# EAGLE design power electronicsV4.4 (EAGLE 9.6.2)

## Sheet 1 of 3
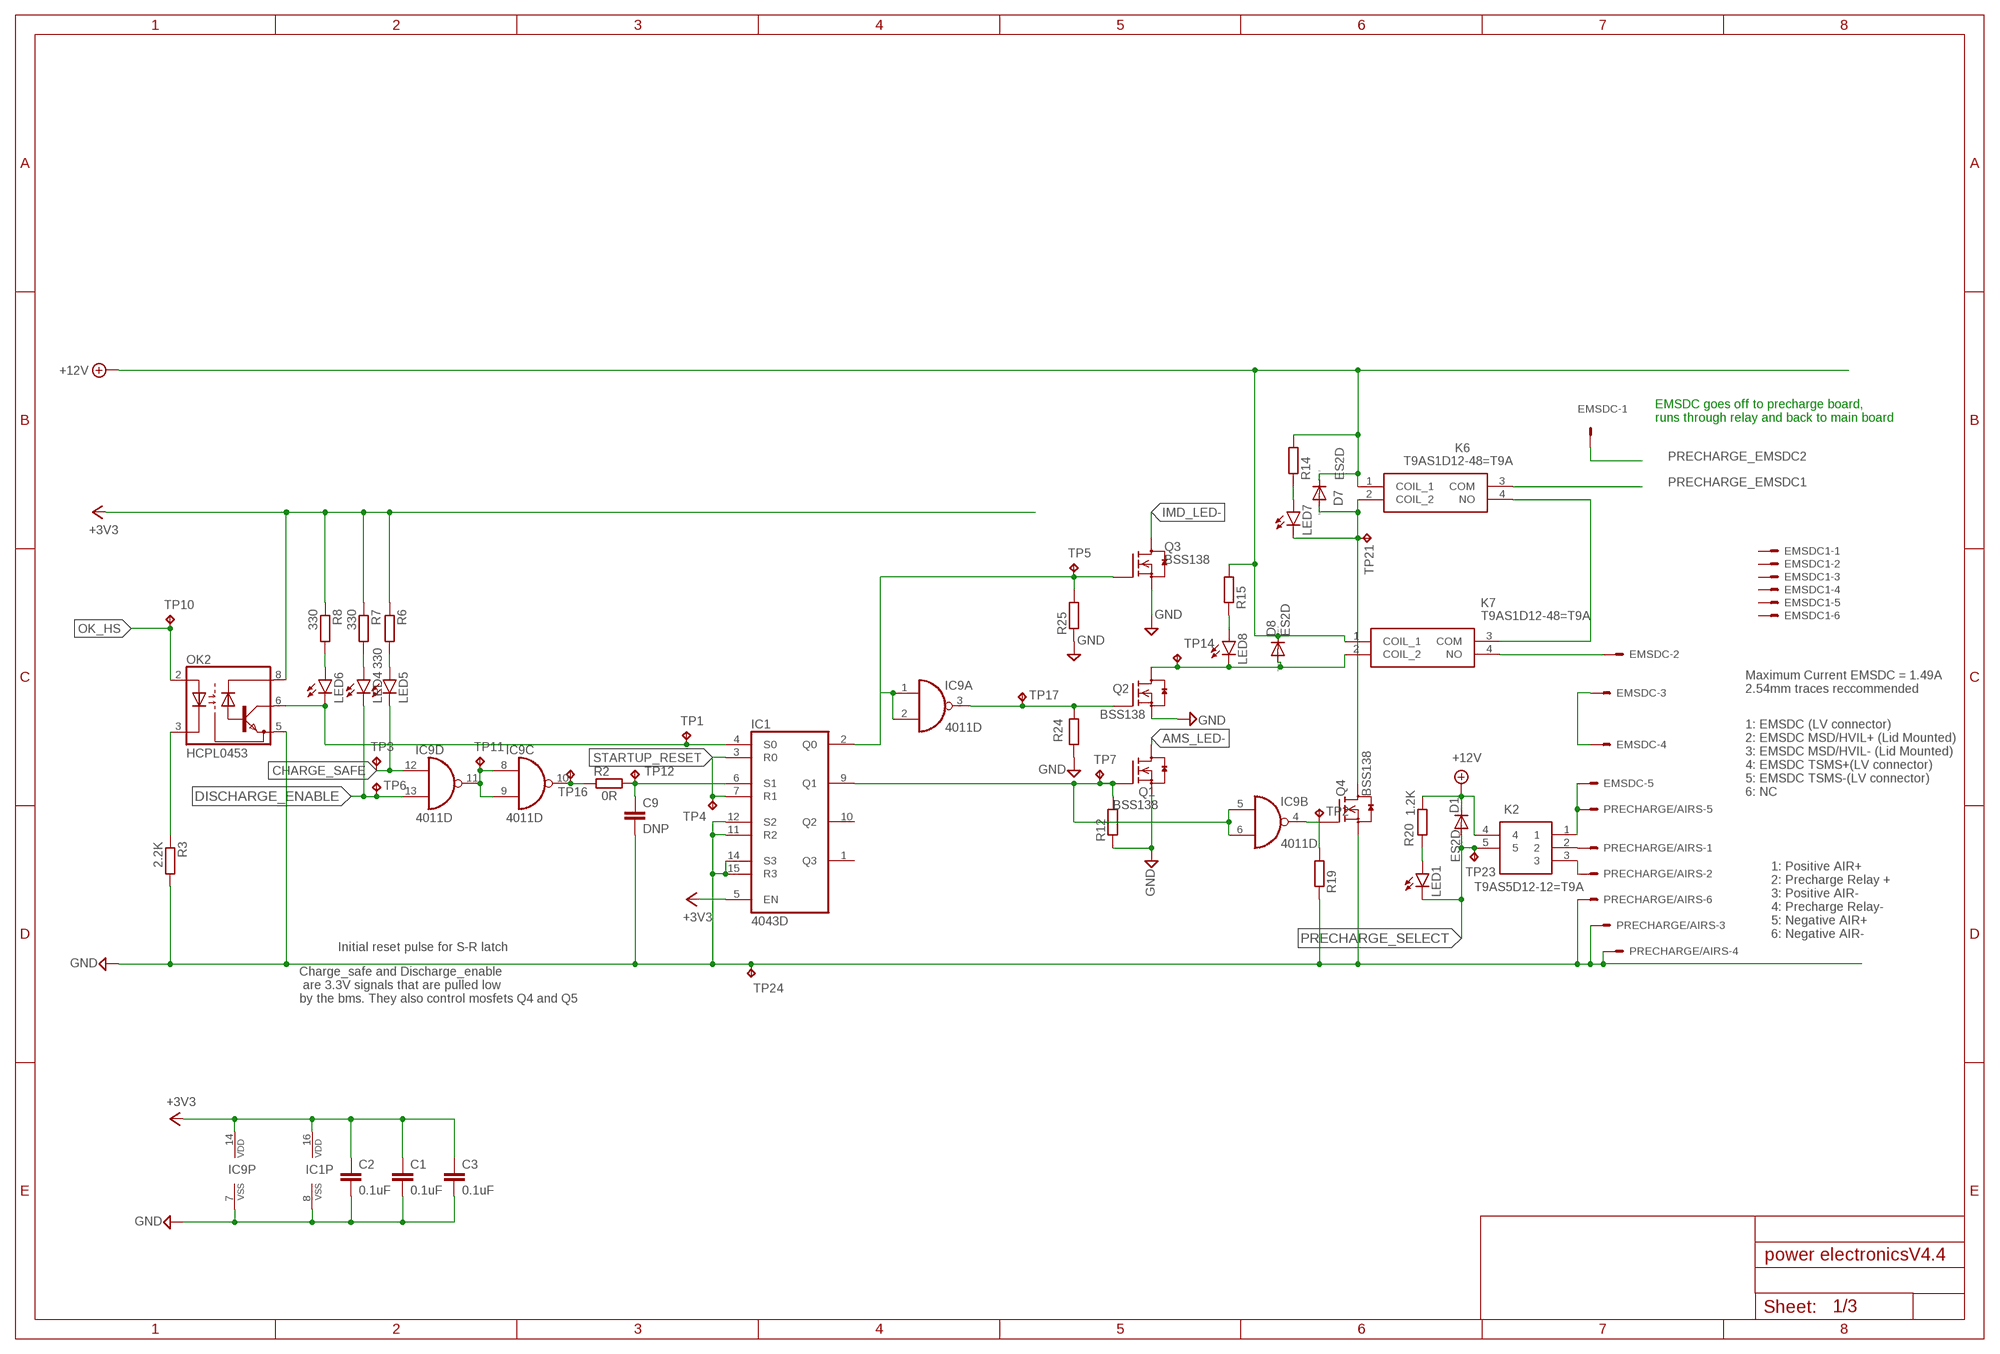
[diagram p0: schematic, sheet 1]

### Parts
C1  0.1uF  C-EUC0805  [C0805]
C2  0.1uF  C-EUC0805  [C0805]
C3  0.1uF  C-EUC0805  [C0805]
C9  DNP  C-EUC0805K  [C0805K]
D1  ES2D  [SMB]
D7  ES2D  [SMB]
D8  ES2D  [SMB]
EMSDC  KK-156-6  [KK-156-6]
EMSDC1  KK-156-6  [KK-156-6]
IC1  4043D  [SO16]
IC9  4011D  [SO14]
K2  T9AS5D12-12=T9A  [T9AS1D12]
K6  T9AS1D12-48=T9A  [T9AS1D1248T9A]
K7  T9AS1D12-48=T9A  [T9AS1D1248T9A]
LED1  LEDSML0805  [SML0805]
LED4  LEDSML0805  [SML0805]
LED5  LEDSML0805  [SML0805]
LED6  LEDSML0805  [SML0805]
LED7  LEDSML0805  [SML0805]
LED8  LEDSML0805  [SML0805]
OK2  HCPL0453  [SOIC08]
PRECHARGE/AIRS  KK-156-6  [KK-156-6]
Q1  BSS138  [SOT23]
Q2  BSS138  [SOT23]
Q3  BSS138  [SOT23]
Q4  BSS138  [SOT23]
R2  0R  R-EU_R0805  [R0805]
R3  2.2K  R-EU_R0805  [R0805]
R6  330  R-EU_R0805  [R0805]
R7  330  R-EU_R0805  [R0805]
R8  330  R-EU_R0805  [R0805]
R12  R-EU_R0805  [R0805]
R14  R-EU_R0805  [R0805]
R15  R-EU_R0805  [R0805]
R19  R-EU_R0805  [R0805]
R20  1.2K  R-EU_R0805  [R0805]
R24  R-EU_R0805  [R0805]
R25  R-EU_R0805  [R0805]
TP1  TPPAD1-17  [P1-17]
TP2  TPPAD1-17  [P1-17]
TP3  TPPAD1-17  [P1-17]
TP4  TPPAD1-17  [P1-17]
TP5  TPPAD1-17  [P1-17]
TP6  TPPAD1-17  [P1-17]
TP7  TPPAD1-17  [P1-17]
TP10  TPPAD1-17  [P1-17]
TP11  TPPAD1-17  [P1-17]
TP12  TPPAD1-17  [P1-17]
TP14  TPPAD1-17  [P1-17]
TP16  TPPAD1-17  [P1-17]
TP17  TPPAD1-17  [P1-17]
TP21  TPPAD1-17  [P1-17]
TP23  TPPAD1-17  [P1-17]
TP24  TPPAD1-17  [P1-17]

### Nets
+3V3: C1.1 C2.1 C3.1 IC1.5(EN) IC1.16(VDD) IC9.14(P:VDD) OK2.8(VCC) R6.1 R7.1 R8.1 ; also sheet 2,3
+12V [power]: D1.C D7.C D8.C K2.4 K6.1(COIL_1) K7.1(COIL_1) R14.2 R15.2 R20.1 ; also sheet 2,3
AMS_LED-: Q1.3(D) ; also sheet 3
CHARGE_SAFE: IC9.12(D:I0) LED5.C TP3.TP ; also sheet 3
DISCHARGE_ENABLE: IC1.9(Q1) IC9.5(B:I0) IC9.6(B:I1) IC9.13(D:I1) LED4.C Q1.1(G) R12.2 TP6.TP TP7.TP ; also sheet 3
GND [GND]: C1.2 C2.2 C3.2 C9.2 IC1.8(VSS) IC1.11(R2) IC1.12(S2) IC1.14(S3) IC1.15(R3) IC9.7(P:VSS) OK2.5(GND) PRECHARGE/AIRS.3 PRECHARGE/AIRS.4 PRECHARGE/AIRS.6 Q1.2(S) Q2.2(S) Q3.2(S) Q4.2(S) R3.2 R12.1 R19.1 R24.1 R25.1 TP24.TP ; also sheet 2,3
IMD_COIL_OUT: D8.A K7.2(COIL_2) LED8.C Q2.3(D) TP14.TP
IMD_LED-: Q3.3(D) ; also sheet 3
N$1: IC9.10(C:O) R2.1 TP16.TP
N$3 [EMSDC]: K2.2 PRECHARGE/AIRS.1
N$5: IC1.4(S0) LED6.C OK2.6(VO) TP1.TP
N$6: IC9.8(C:I0) IC9.9(C:I1) IC9.11(D:O) TP11.TP
N$7: OK2.3(C) R3.1
N$8: IC9.3(A:O) Q2.1(G) R24.2 TP17.TP
N$9: IC1.2(Q0) IC9.1(A:I0) IC9.2(A:I1) Q3.1(G) R25.2 TP5.TP
N$10: C9.1 IC1.6(S1) R2.2 TP12.TP
N$11 [EMSDC]: EMSDC.5 K2.1 PRECHARGE/AIRS.5
N$12 [EMSDC]: K2.3 PRECHARGE/AIRS.2
N$14: EMSDC.2 K7.4(NO)
N$15 [GND]: D7.A K6.2(COIL_2) LED7.C Q4.3(D) TP21.TP
N$16: IC9.4(B:O) Q4.1(G) R19.2 TP2.TP
N$18: LED7.A R14.1
N$19 [EMSDC]: EMSDC.3 EMSDC.4
N$20: LED8.A R15.1
N$21 [GND]: K6.4(NO) K7.3(COM)
N$22: LED1.A R20.2
N$25: LED4.A R7.2
N$26: LED5.A R6.2
N$27: LED6.A R8.2
OK_HS: OK2.2(A) TP10.TP ; also sheet 3
PRECHARGE_EMSDC1: K6.3(COM) ; also sheet 3
PRECHARGE_EMSDC2: EMSDC.1 ; also sheet 3
PRECHARGE_SELECT: D1.A K2.5 LED1.C TP23.TP ; also sheet 3
STARTUP_RESET: IC1.3(R0) IC1.7(R1) TP4.TP ; also sheet 2
Unconnected: EMSDC1.1 EMSDC1.2 EMSDC1.3 EMSDC1.4 EMSDC1.5 EMSDC1.6 EMSDC.6 IC1.1(Q3) IC1.10(Q2)

### Notes on the sheet
- EMSDC goes off to precharge board, 
  runs through relay and back to main board
- Maximum Current EMSDC = 1.49A
  2.54mm traces reccommended
- 1: EMSDC (LV connector)
  2: EMSDC MSD/HVIL+ (Lid Mounted)
  3: EMSDC MSD/HVIL- (Lid Mounted)
  4: EMSDC TSMS+(LV connector)
  5: EMSDC TSMS-(LV connector)
  6: NC
- 1: Positive AIR+
  2: Precharge Relay +
  3: Positive AIR-
  4: Precharge Relay-
  5: Negative AIR+
  6: Negative AIR-
- Initial reset pulse for S-R latch
- Charge_safe and Discharge_enable
   are 3.3V signals that are pulled low 
  by the bms. They also control mosfets Q4 and Q5

## Sheet 2 of 3
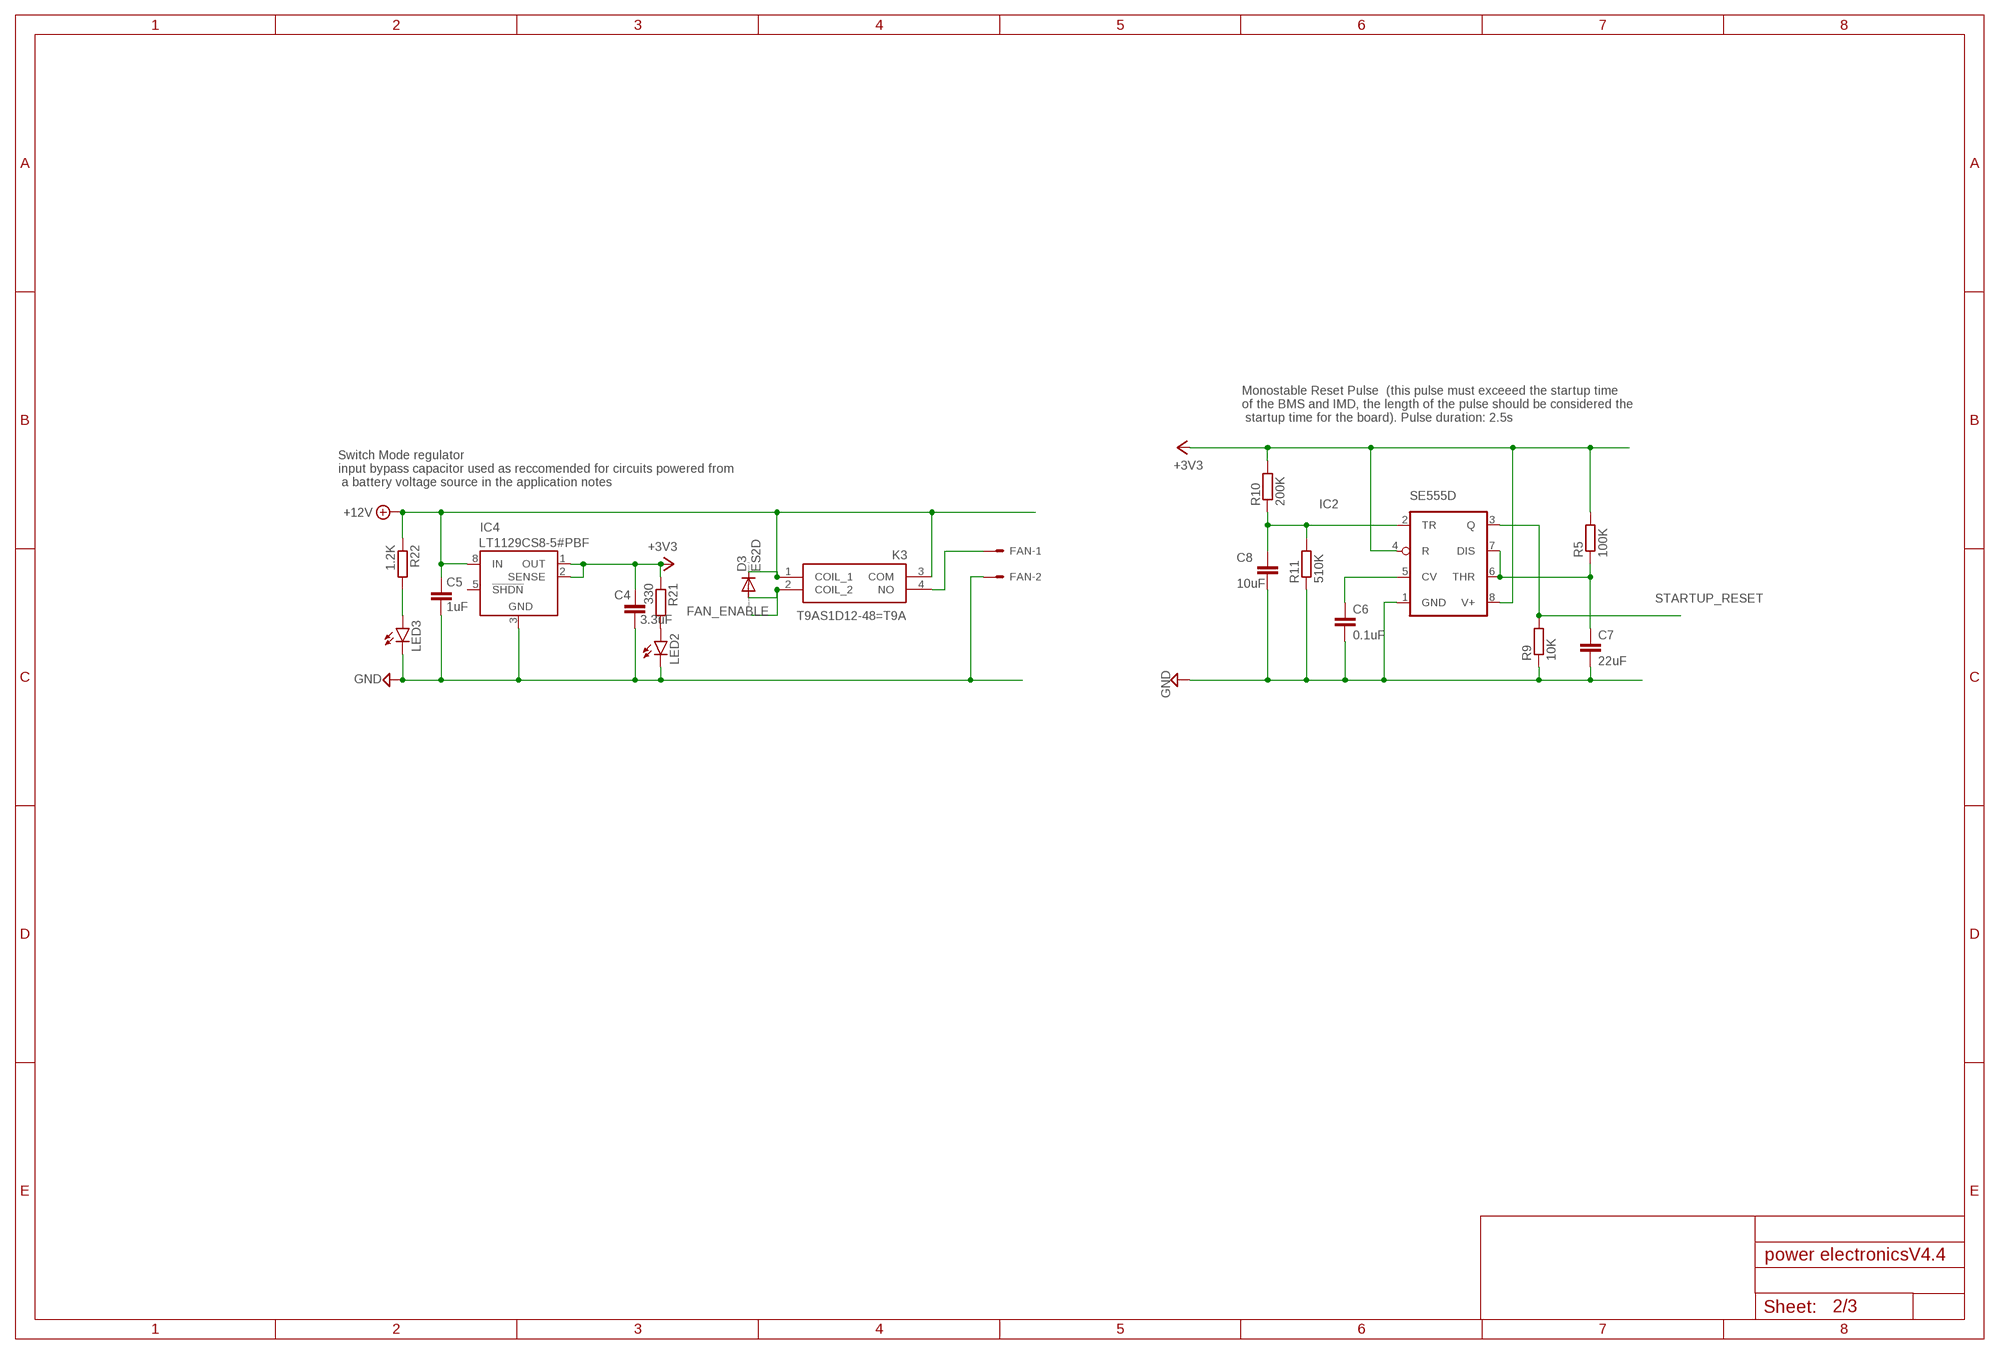
[diagram p1: schematic, sheet 2]

### Parts
C4  3.3uF  C-EUC0805  [C0805]
C5  1uF  C-EUC0805  [C0805]
C6  0.1uF  C-EUC0805  [C0805]
C7  22uF  C-EUC1206  [C1206]
C8  10uF  C-EUC0805  [C0805]
D3  ES2D  [SMB]
FAN  KK-156-2  [KK-156-2]
IC2  SE555D  [SO08]
IC4  LT1129CS8  [SOIC8]
K3  T9AS1D12-48=T9A  [T9AS1D1248T9A]
LED2  LEDSML0805  [SML0805]
LED3  LEDSML0805  [SML0805]
R5  100K  R-EU_R0805  [R0805]
R9  10K  R-EU_R0805  [R0805]
R10  200K  R-EU_R0805  [R0805]
R11  510K  R-EU_R0805  [R0805]
R21  330  R-EU_R0805  [R0805]
R22  1.2K  R-EU_R0805  [R0805]

### Nets
+3V3: C4.1 IC2.4(R) IC2.8(V+) IC4.1(OUT) IC4.2(SENSE) R5.2 R10.2 R21.1 ; also sheet 1,3
+12V [power]: C5.1 D3.C IC4.8(IN) K3.1(COIL_1) K3.3(COM) R22.1 ; also sheet 1,3
FAN+ [power]: FAN.1 K3.4(NO)
FAN_ENABLE: D3.A K3.2(COIL_2) ; also sheet 3
GND [GND]: C4.2 C5.2 C6.2 C7.2 C8.2 FAN.2 IC2.1(GND) IC4.3(GND) LED2.C LED3.C R9.1 R11.1 ; also sheet 1,3
N$17: C7.1 IC2.6(THR) IC2.7(DIS) R5.1
N$23: LED2.A R21.2
N$24: LED3.A R22.2
N$28: C8.1 IC2.2(TR) R10.1 R11.2
N$32: C6.1 IC2.5(CV)
STARTUP_RESET: IC2.3(Q) R9.2 ; also sheet 1
Unconnected: IC4.4(NC) IC4.5(!SHDN)

### Notes on the sheet
- Monostable Reset Pulse  (this pulse must exceeed the startup time 
  of the BMS and IMD, the length of the pulse should be considered the
   startup time for the board). Pulse duration: 2.5s
- Switch Mode regulator
  input bypass capacitor used as reccomended for circuits powered from
   a battery voltage source in the application notes

## Sheet 3 of 3
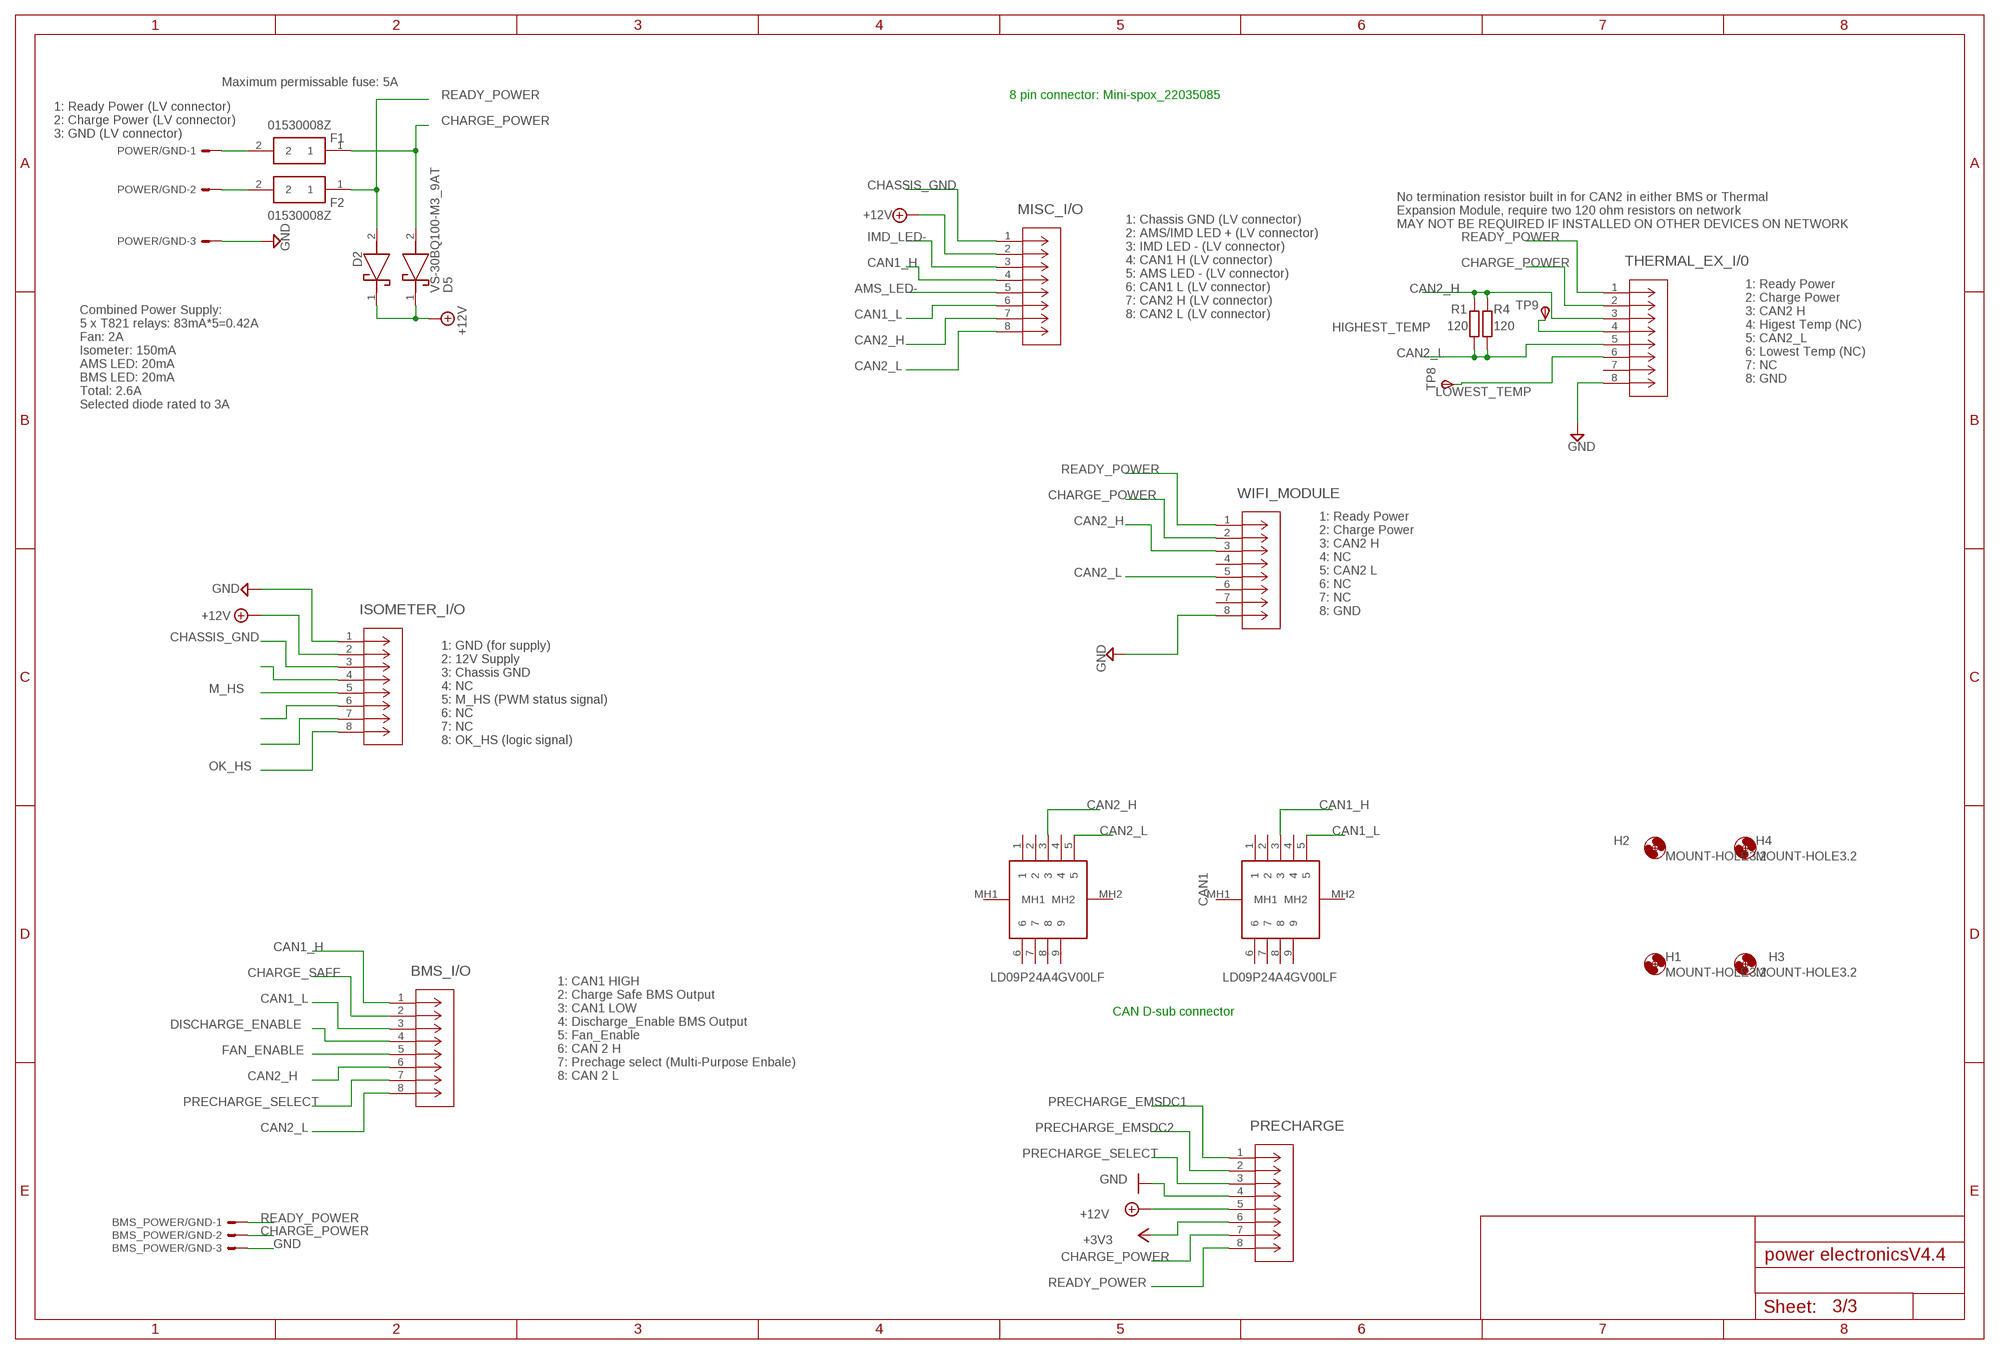
[diagram p2: schematic, sheet 3]

### Parts
BMS_I/O  MINI-SPOX_22035085  [CON_22035085_MOL]
BMS_POWER/GND  KK-156-3  [KK-156-3]
CAN1  LD09P24A4GV00LF  [LD09P24A4GV00LF]
CAN2  LD09P24A4GV00LF  [LD09P24A4GV00LF]
D2  VS-30BQ100-M3_9AT  [DIOM7959X262N]
D5  VS-30BQ100-M3_9AT  [DIOM7959X262N]
F1  01530008Z  [01530008]
F2  01530008Z  [01530008]
H1  MOUNT-HOLE3.2  [3,2]
H2  MOUNT-HOLE3.2  [3,2]
H3  MOUNT-HOLE3.2  [3,2]
H4  MOUNT-HOLE3.2  [3,2]
ISOMETER_I/O  MINI-SPOX_22035085  [CON_22035085_MOL]
MISC_I/O  MINI-SPOX_22035085  [CON_22035085_MOL]
POWER/GND  KK-156-3  [KK-156-3]
PRECHARGE  MINI-SPOX_22035085  [CON_22035085_MOL]
R1  120  R-EU_R1206  [R1206]
R4  120  R-EU_R1206  [R1206]
THERMAL_EX_I/0  MINI-SPOX_22035085  [CON_22035085_MOL]
TP8  TPSTP11R  [TP11R]
TP9  TPSTP11R  [TP11R]
WIFI_MODULE  MINI-SPOX_22035085  [CON_22035085_MOL]

### Nets
+3V3: PRECHARGE.6 ; also sheet 1,2
+12V [power]: D2.1(K) D5.1(K) ISOMETER_I/O.2 MISC_I/O.2 PRECHARGE.5 ; also sheet 1,2
AMS_LED-: MISC_I/O.5 ; also sheet 1
CAN1_H: BMS_I/O.1 CAN1.3 MISC_I/O.4
CAN1_L: BMS_I/O.3 CAN1.5 MISC_I/O.6
CAN2_H: BMS_I/O.6 CAN2.3 MISC_I/O.7 R1.1 R4.1 THERMAL_EX_I/0.3 WIFI_MODULE.3
CAN2_L: BMS_I/O.8 CAN2.5 MISC_I/O.8 R1.2 R4.2 THERMAL_EX_I/0.5 WIFI_MODULE.5
CHARGE_POWER [power]: BMS_POWER/GND.2 D5.2(A) F1.1 PRECHARGE.7 THERMAL_EX_I/0.2 WIFI_MODULE.2
CHARGE_SAFE: BMS_I/O.2 ; also sheet 1
CHASSIS_GND [GND]: ISOMETER_I/O.3 MISC_I/O.1
DISCHARGE_ENABLE: BMS_I/O.4 ; also sheet 1
FAN_ENABLE: BMS_I/O.5 ; also sheet 2
GND [GND]: BMS_POWER/GND.3 ISOMETER_I/O.1 POWER/GND.3 PRECHARGE.4 THERMAL_EX_I/0.8 WIFI_MODULE.8 ; also sheet 1,2
HIGHEST_TEMP: THERMAL_EX_I/0.4 TP9.TP(PP)
IMD_LED-: MISC_I/O.3 ; also sheet 1
LOWEST_TEMP: THERMAL_EX_I/0.6 TP8.TP(PP)
M_HS: ISOMETER_I/O.5
N$2 [power]: F2.2 POWER/GND.2
N$4 [power]: F1.2 POWER/GND.1
N$46: ISOMETER_I/O.4
N$51: ISOMETER_I/O.7
N$52: ISOMETER_I/O.6
OK_HS: ISOMETER_I/O.8 ; also sheet 1
PRECHARGE_EMSDC1: PRECHARGE.1 ; also sheet 1
PRECHARGE_EMSDC2: PRECHARGE.2 ; also sheet 1
PRECHARGE_SELECT: BMS_I/O.7 PRECHARGE.3 ; also sheet 1
READY_POWER [power]: BMS_POWER/GND.1 D2.2(A) F2.1 PRECHARGE.8 THERMAL_EX_I/0.1 WIFI_MODULE.1
Unconnected: CAN1.1 CAN1.2 CAN1.4 CAN1.6 CAN1.7 CAN1.8 CAN1.9 CAN1.MH1 CAN1.MH2 CAN2.1 CAN2.2 CAN2.4 CAN2.6 CAN2.7 CAN2.8 CAN2.9 CAN2.MH1 CAN2.MH2 THERMAL_EX_I/0.7 WIFI_MODULE.4 WIFI_MODULE.6 WIFI_MODULE.7

### Notes on the sheet
- Maximum permissable fuse: 5A
- 8 pin connector: Mini-spox_22035085
- 1: Ready Power (LV connector)
  2: Charge Power (LV connector)
  3: GND (LV connector)
- No termination resistor built in for CAN2 in either BMS or Thermal
  Expansion Module, require two 120 ohm resistors on network
  MAY NOT BE REQUIRED IF INSTALLED ON OTHER DEVICES ON NETWORK
- 1: Chassis GND (LV connector)
  2: AMS/IMD LED + (LV connector)
  3: IMD LED - (LV connector)
  4: CAN1 H (LV connector)
  5: AMS LED - (LV connector)
  6: CAN1 L (LV connector)
  7: CAN2 H (LV connector)
  8: CAN2 L (LV connector)
- 1: Ready Power
  2: Charge Power
  3: CAN2 H
  4: Higest Temp (NC)
  5: CAN2_L
  6: Lowest Temp (NC)
  7: NC
  8: GND
- Combined Power Supply:
  5 x T821 relays: 83mA*5=0.42A
  Fan: 2A
  Isometer: 150mA
  AMS LED: 20mA
  BMS LED: 20mA
  Total: 2.6A
  Selected diode rated to 3A
- 1: Ready Power
  2: Charge Power
  3: CAN2 H
  4: NC
  5: CAN2 L
  6: NC
  7: NC
  8: GND
- 1: GND (for supply) 
  2: 12V Supply
  3: Chassis GND 
  4: NC 
  5: M_HS (PWM status signal)
  6: NC
  7: NC
  8: OK_HS (logic signal)
- CAN D-sub connector
- 1: CAN1 HIGH
  2: Charge Safe BMS Output 
  3: CAN1 LOW
  4: Discharge_Enable BMS Output
  5: Fan_Enable
  6: CAN 2 H
  7: Prechage select (Multi-Purpose Enbale)
  8: CAN 2 L

## Power pins joined to a net without a drawn wire
GND: IC4.6(GND) IC4.7(GND)

## Library data of the parts
BMS_I/O ISOMETER_I/O MISC_I/O PRECHARGE THERMAL_EX_I/0 WIFI_MODULE = Mini-spox_22035085:MINI-SPOX_22035085; COPYRIGHT: Copyright (C) 2023 Ultra Librarian. All rights reserved.; MANUFACTURER_PART_NUMBER: 22035085; MFR_NAME: Molex Connector Corporation
BMS_POWER/GND POWER/GND = con-molex:KK-156-3: KK 156 HEADER Source: http://www.molex.com/pdm_docs/sd/026604100_sd.pdf; MF: MOLEX; OC_FARNELL: unknown; OC_NEWARK: unknown
C1-C9 = rcl:C-EU: CAPACITOR, European symbol; SPICEPREFIX: C
CAN1 CAN2 = LD09P24A4GV00LF:LD09P24A4GV00LF: Amphenol FCI LD Series, 9 Way Plug-In Mount D-sub Connector Plug, 2.74mm Pitch, with Screw Source: Datasheet <https://www.mouser.com/datasheet/2/18/10130912-1362365.pdf>; ARROW_PART_NUMBER: LD09P24A4GV00LF; ARROW_PRICE-STOCK: https://www.arrow.com/en/products/ld09p24a4gv00lf/amphenol-fci?region=nac; DESCRIPTION: Amphenol FCI LD Series, 9 Way Plug-In Mount D-sub Connector Plug, 2.74mm Pitch, with Screw; HEIGHT: 12.15mm; MANUFACTURER_NAME: Amphenol Communication Solutions; MANUFACTURER_PART_NUMBER: LD09P24A4GV00LF; MOUSER_PART_NUMBER: 649-LD09P24A4GV00LF; MOUSER_PRICE-STOCK: https://www.mouser.co.uk/ProductDetail/Amphenol-FCI/LD09P24A4GV00LF?qs=tZOhSuJQg1nfkziarphghA%3D%3D
D1 D3 D7 D8 = diode:ES2D: DIODE super fast rectifier, 2 A
D2 D5 = SamacSys_Parts:VS-30BQ100-M3_9AT: Vishay VS-30BQ100-M3/9AT SMT Schottky Diode, 100V 3A, 2-Pin DO-214AB Source: Datasheet <https://componentsearchengine.com/Datasheets/1/VS-30BQ100-M3_9AT.pdf>; DESCRIPTION: Vishay VS-30BQ100-M3/9AT SMT Schottky Diode, 100V 3A, 2-Pin DO-214AB; HEIGHT: 2.62mm; MANUFACTURER_NAME: Vishay; MANUFACTURER_PART_NUMBER: VS-30BQ100-M3/9AT; MOUSER_PART_NUMBER: 78-VS-30BQ100-M39AT; MOUSER_PRICE-STOCK: https://www.mouser.com/Search/Refine.aspx?Keyword=78-VS-30BQ100-M39AT
EMSDC EMSDC1 PRECHARGE/AIRS = con-molex:KK-156-6: KK 156 HEADER Source: http://www.molex.com/pdm_docs/sd/026604100_sd.pdf; MF: MOLEX; OC_FARNELL: unknown; OC_NEWARK: unknown
F1 F2 = SamacSys_Parts:01530008Z: Mini fuseholder,15A 32V Littelfuse 15A PCB Mount Fuse Holder Automotive Fuse, 32 V Source: Datasheet <http://www.littelfuse.com/data/en/data_sheets/153_pcmount.pdf>; ALLIED_NUMBER: 70184304; DESCRIPTION: Mini fuseholder,15A 32V Littelfuse 15A PCB Mount Fuse Holder Automotive Fuse, 32 V; HEIGHT: mm; MANUFACTURER_NAME: LITTELFUSE; MANUFACTURER_PART_NUMBER: 01530008Z; RS_PART_NUMBER: 3607317; RS_PRICE-STOCK: https://uk.rs-online.com/web/p/products/3607317
FAN = con-molex:KK-156-2: KK 156 HEADER Source: http://www.molex.com/pdm_docs/sd/026604100_sd.pdf; MF: MOLEX; OC_FARNELL: unknown; OC_NEWARK: unknown
H1-H4 = holes:MOUNT-HOLE: MOUNTING HOLE with drill center marker
IC1 = 40xx:4043: Quad 3-state NOR R/S LATCH
IC2 = linear:*555: TIMER
IC4 = linear-technology:LT1129CS8: VOLTAGE REGULATOR with shutdown; MPN: LT1129CS8-5#PBF; OC_FARNELL: 1273576; OC_NEWARK: 57M2078
IC9 = 40xx:4011: Quad 2-input NAND
K2 = SamacSys_Parts:T9AS5D12-12=T9A: PCB Relay SPDT 30A 12Vdc,thru hole SPDT PCB Mount Non-Latching Relay Through Hole, 12V dc Source: Datasheet; ALLIED_NUMBER: R1111589; DESCRIPTION: PCB Relay SPDT 30A 12Vdc,thru hole SPDT PCB Mount Non-Latching Relay Through Hole, 12V dc; HEIGHT: mm; MANUFACTURER_NAME: TE Connectivity; MANUFACTURER_PART_NUMBER: T9AS5D12-12=T9A; RS_PART_NUMBER: 6802528; RS_PRICE-STOCK: https://uk.rs-online.com/web/p/products/6802528
K3 = SamacSys_Parts:T9AS1D12-48=T9A: SPST-NO PCB Mount Non-Latching Relay Through Hole, 48V dc Source: Datasheet; DESCRIPTION: SPST-NO PCB Mount Non-Latching Relay Through Hole, 48V dc; HEIGHT: 20.4mm; MANUFACTURER_NAME: TE Connectivity; MANUFACTURER_PART_NUMBER: T9AS1D12-48=T9A; RS_PART_NUMBER: 6802534P; RS_PRICE-STOCK: http://uk.rs-online.com/web/p/products/6802534P
K6 K7 = T9AS1D12-12=T9A:T9AS1D12-48=T9A: SPST-NO PCB Mount Non-Latching Relay Through Hole, 48V dc Source: Datasheet; DESCRIPTION: SPST-NO PCB Mount Non-Latching Relay Through Hole, 48V dc; HEIGHT: 20.4mm; MANUFACTURER_NAME: TE Connectivity; MANUFACTURER_PART_NUMBER: T9AS1D12-48=T9A
LED1-LED8 = led:LED: LED OSRAM: - CHIPLED LG R971, LG N971, LY N971, LG Q971, LY Q971, LO R971, LY R971 LH N974, LH R974 LS Q976, LO Q976, LY Q976 LO Q996 - Hyper CHIPLED LW Q18S LB Q993, LB Q99A, LB R99A - SideLED LS A670, LO A670, LY A670, LG A670, LP A670 LB A673, LV A673, LT A673, LW A673 LH A674 LY A675 LS A676, LA A676, LO A676, LY A676, LW A676 LS A679, LY A679, LG A679 - Hyper Micro SIDELED® LS Y876, LA Y876, LO Y876, LY Y876 LT Y87S - SmartLED LW L88C, LW L88S LB L89C, LB L89S, LG L890 LS L89K, LO L89K, LY L89K LS L896, LA L896, LO L896, LY L896 - TOPLED LS T670, LO T670, LY T670, LG T670, LP T670 LSG T670, LSP T670, LSY T670, LOP T670, LYG T670 LG T671, LOG T671, LSG T671 LB T673, LV T673, LT T673, LW T673 LH T674 LS T676, LA T676, LO T676, LY T676, LB T676, LH T676, LSB T676, LW T676 LB T67C, LV T67C, LT T67C, LS T67K, LO T67K, LY T67K, LW E67C LS E67B, LA E67B, LO E67B, LY E67B, LB E67C, LV E67C, LT E67C LW T67C LS T679, LY T679, LG T679 LS T770, LO T770, LY T770, LG T770, LP T770 LB T773, LV T773, LT T773, LW T773 LH T774 LS E675, LA E675, LY E675, LS T675 LS T776, LA T776, LO T776, LY T776, LB T776 LHGB T686 LT T68C, LB T68C - Hyper Mini TOPLED® LB M676 - Mini TOPLED Santana® LG M470 LS M47K, LO M47K, LY M47K Source: http://www.osram.convergy.de LUXEON: - LUMILED® LXK2-PW12-R00, LXK2-PW12-S00, LXK2-PW14-U00, LXK2-PW14-V00 LXK2-PM12-R00, LXK2-PM12-S00, LXK2-PM14-U00 LXK2-PE12-Q00, LXK2-PE12-R00, LXK2-PE12-S00, LXK2-PE14-T00, LXK2-PE14-U00 LXK2-PB12-K00, LXK2-PB12-L00, LXK2-PB12-M00, LXK2-PB14-N00, LXK2-PB14-P00, LXK2-PB14-Q00 LXK2-PR12-L00, LXK2-PR12-M00, LXK2-PR14-Q00, LXK2-PR14-R00 LXK2-PD12-Q00, LXK2-PD12-R00, LXK2-PD12-S00 LXK2-PH12-R00, LXK2-PH12-S00 LXK2-PL12-P00, LXK2-PL12-Q00, LXK2-PL12-R00 Source: www.luxeon.com KINGBRIGHT: KA-3528ASYC Source: www.kingbright.com
OK2 = optocoupler:HCPL0453: HEWLETT PACKARD OPTO COUPLER; MF: AGILENT TECHNOLOGIES; MPN: HCPL-0453-000E; OC_FARNELL: 1505123; OC_NEWARK: 88H7766
Q1-Q4 = m-pad-2.1:BSS138: Fairchild Semiconductors BSS138 N-Channel Logic Level Enhancement Mode Field Effect Transistor General Description: These N-Channel enhancement mode field effect transistors are produced using Fairchild's proprietary, high cell density, DMOS technology. These products have been designed to minimize on-state resistance while provide rugged, reliable, and fast switching performance.These products are particularly suited for low voltage, low current applications such as small servo motor control, power MOSFET gate drivers, and other switching applications. Features: 0.22 A, 50 V. RDS(ON) = 3.5Ohm @ VGS = 10 V RDS(ON) = 6.0Ohm @ VGS = 4.5 V High density cell design for extremely low RDS(ON) Rugged and Reliable Compact industry standard SOT-23 surface mount package Please send any comments to: messi@users.sourceforge.net
R1-R12 R14 R15 R19-R22 R24 R25 = rcl:R-EU_: RESISTOR, European symbol; SPICEPREFIX: R
TP1-TP7 TP10-TP12 TP14 TP16 TP17 TP21 TP23 TP24 = testpad:TP: Test pad
TP8 TP9 = testpad:TPS: TEST PIN

## Net classes
0 default: width 0.508 mm
1 GND: width 0.889 mm
2 EMSDC: width 2.54 mm
3 power: width 0.889 mm

## Board
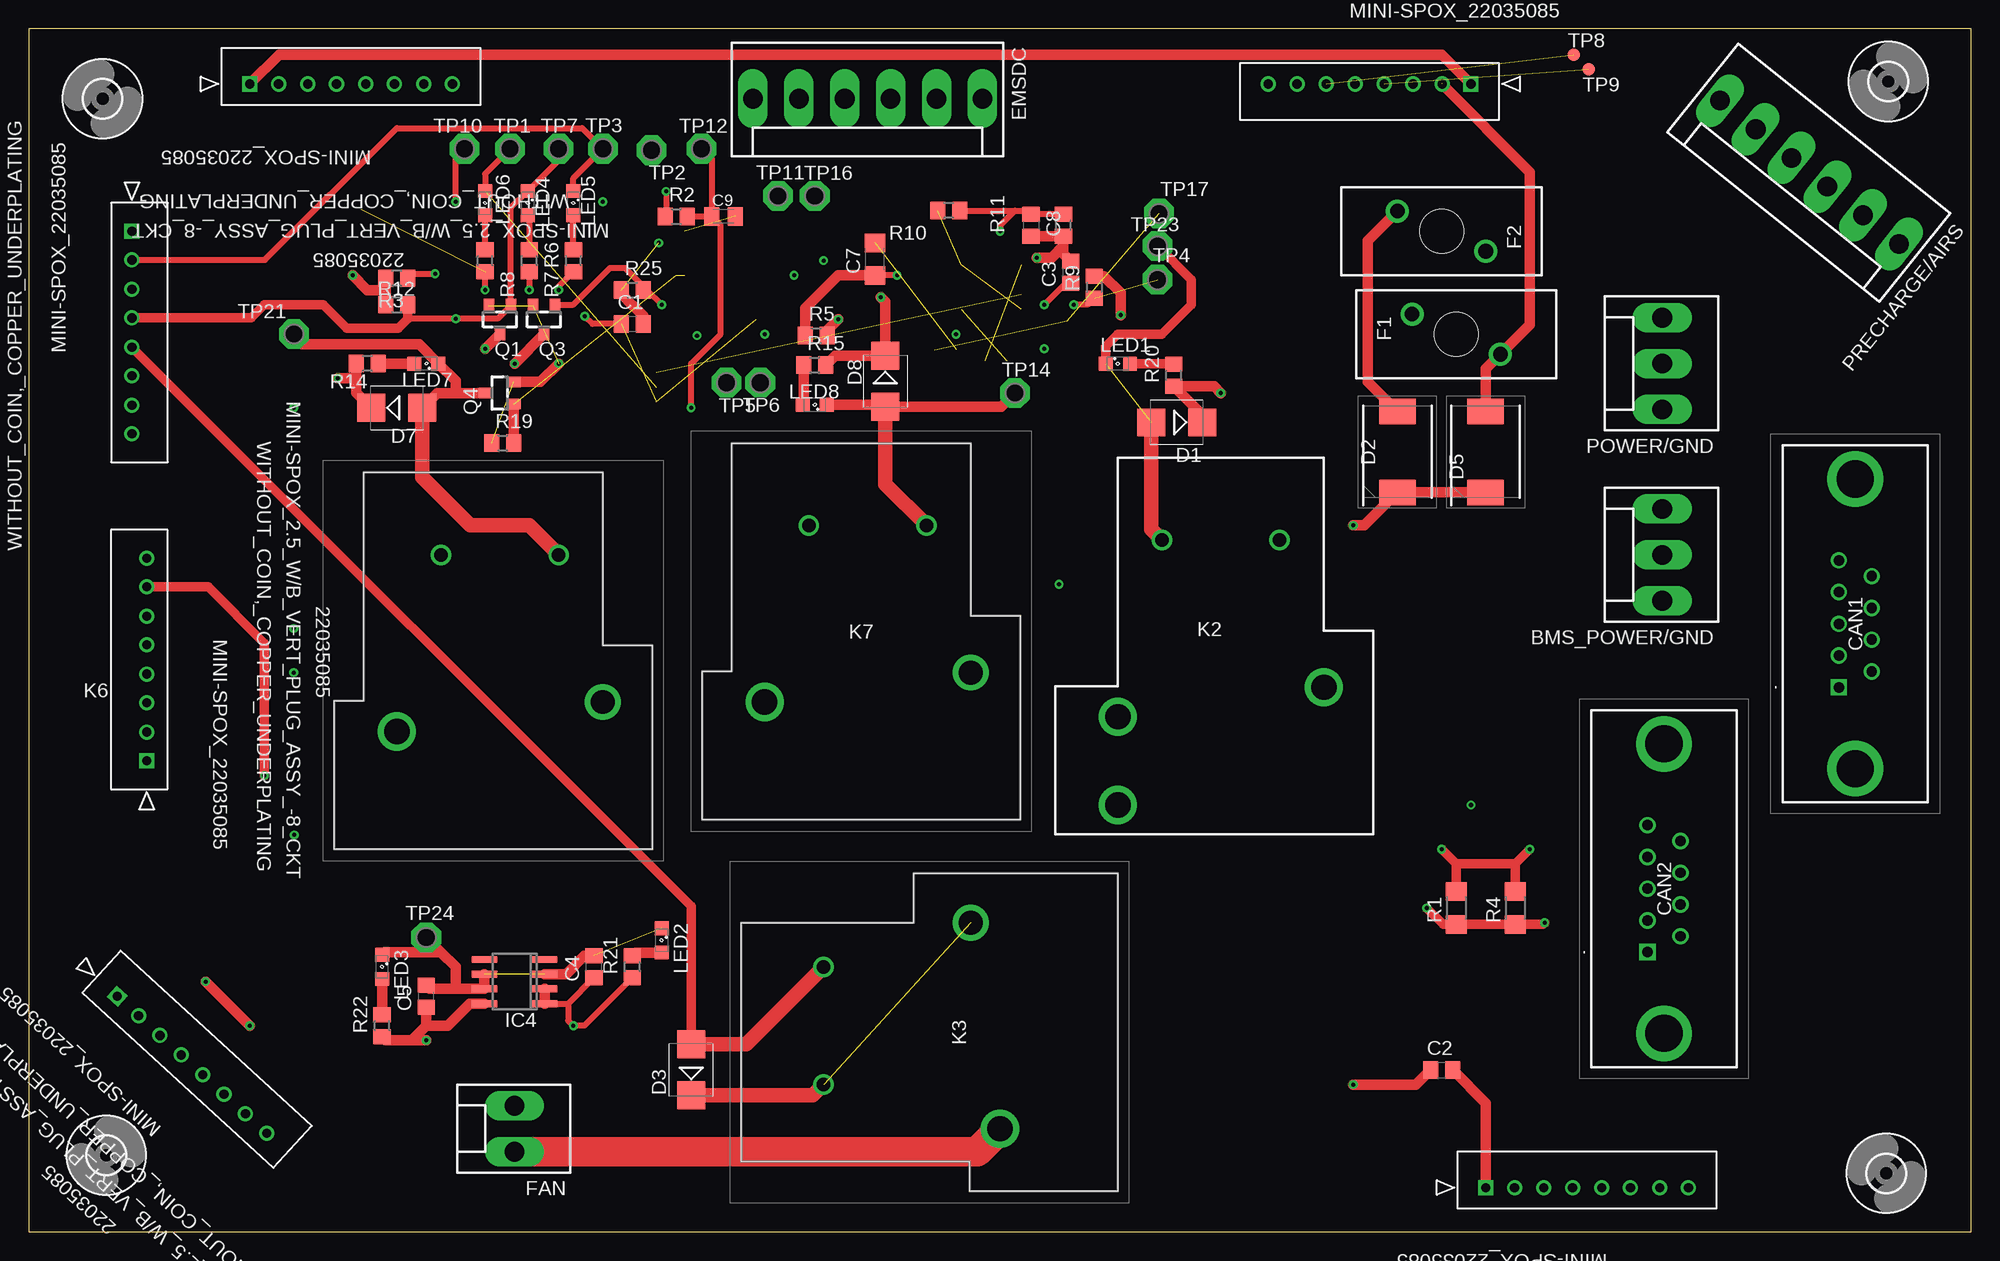
[diagram p3: board, top side]
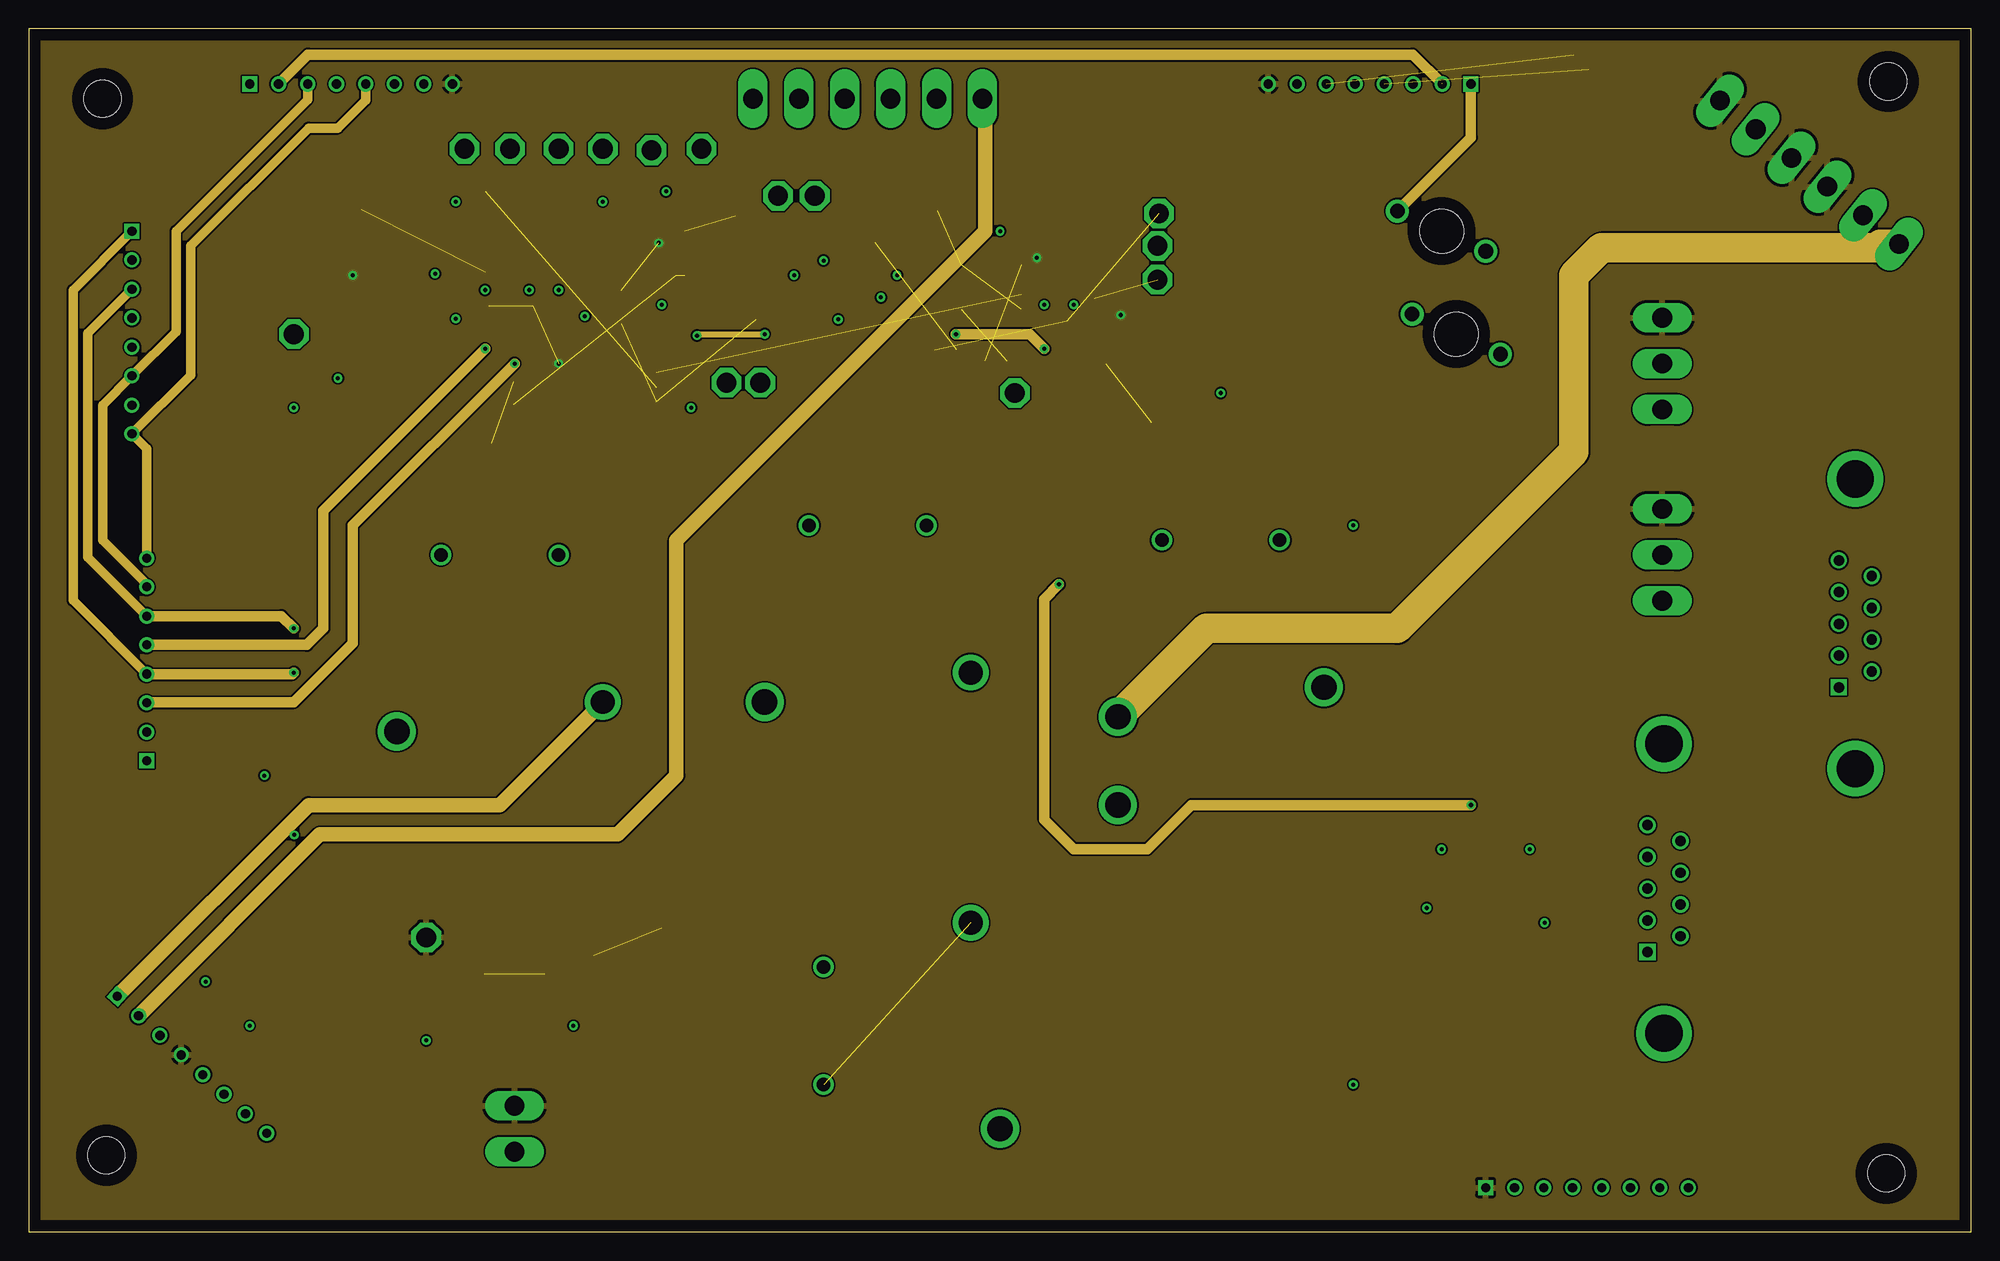
[diagram p4: board, inner layer Route2]
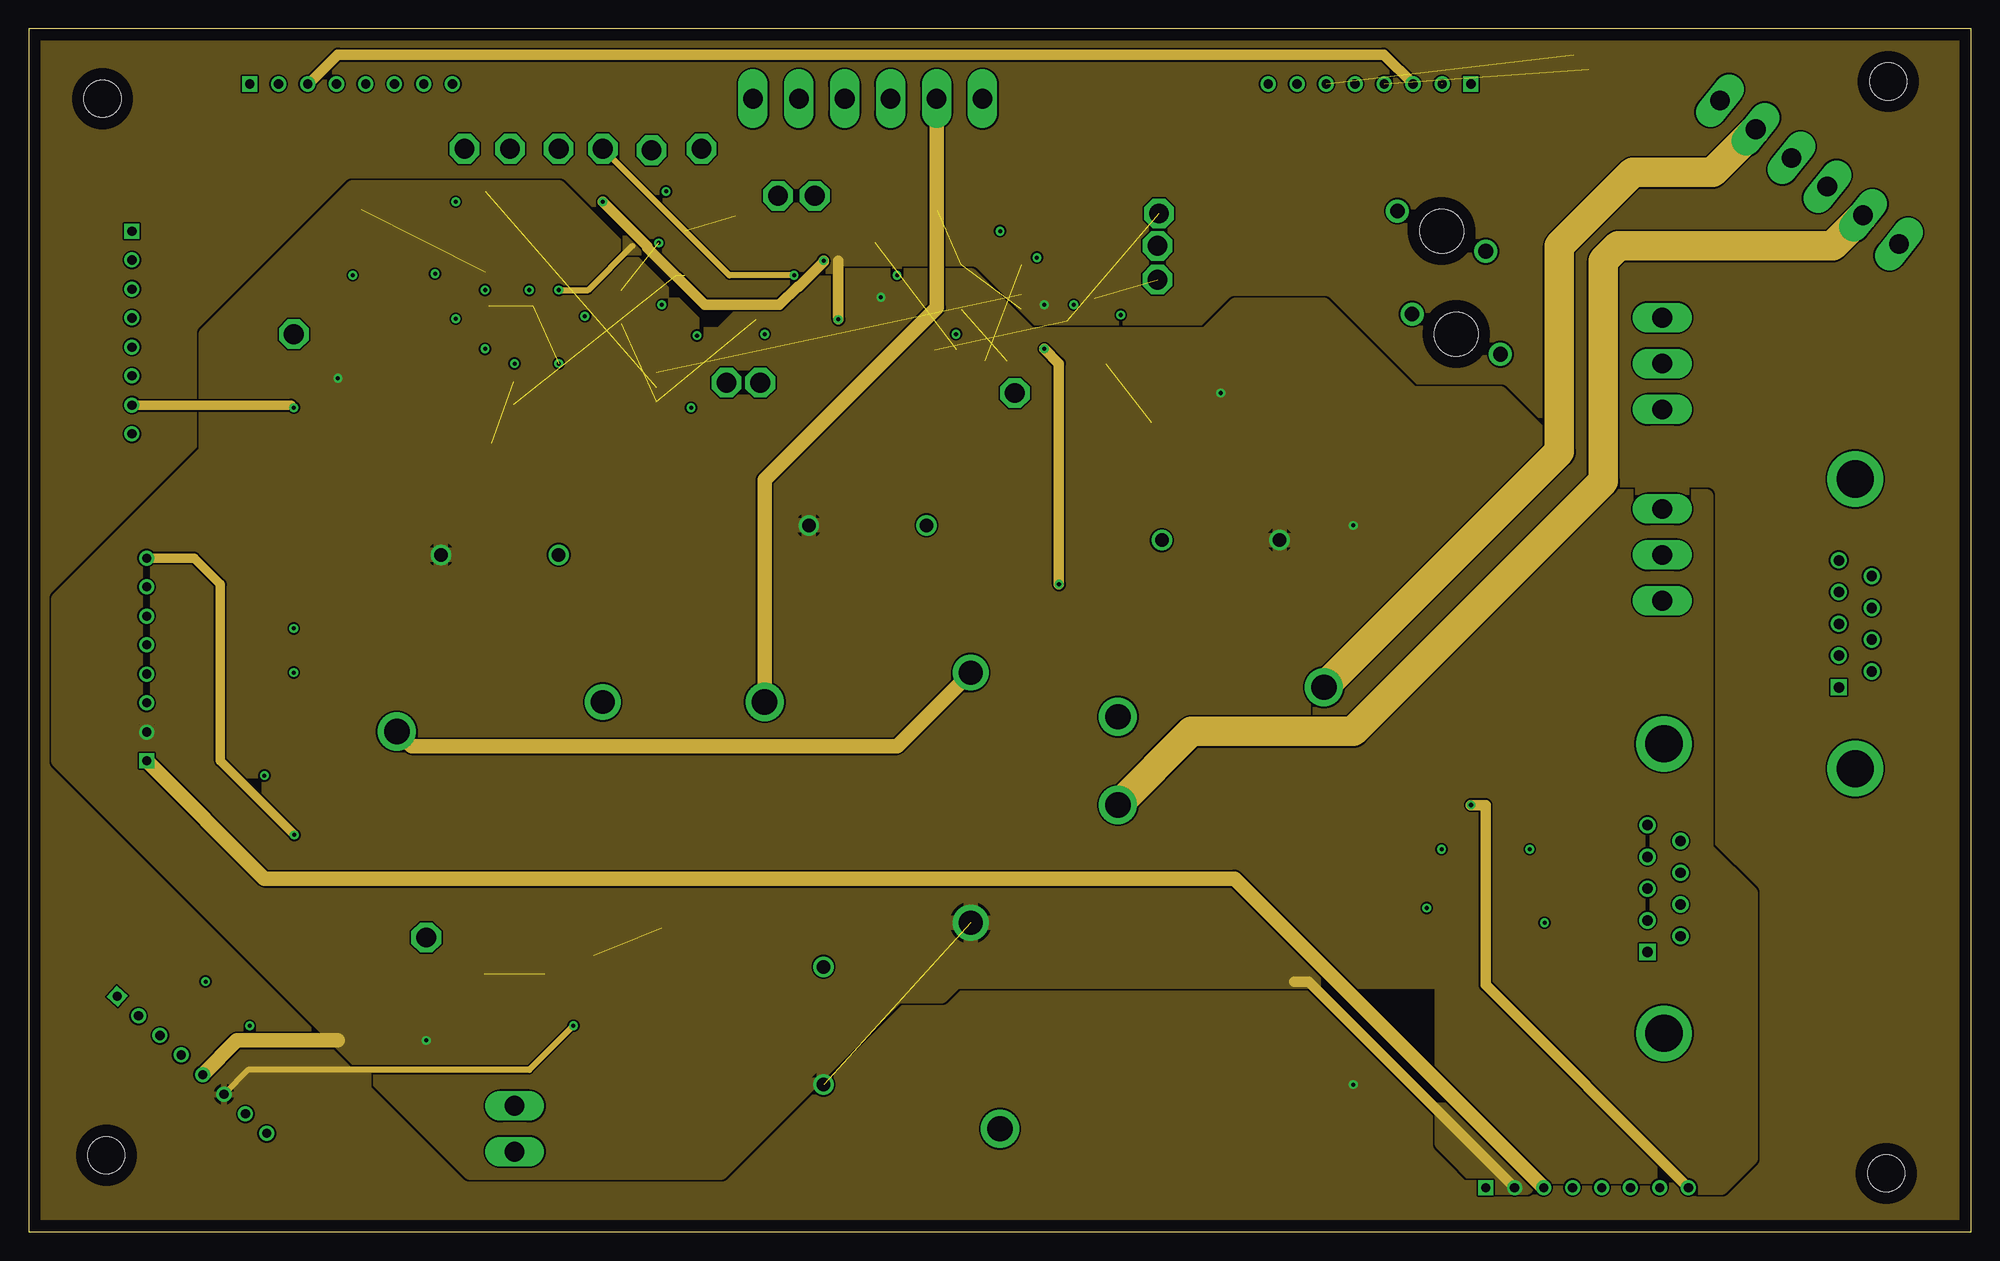
[diagram p5: board, inner layer Route15]
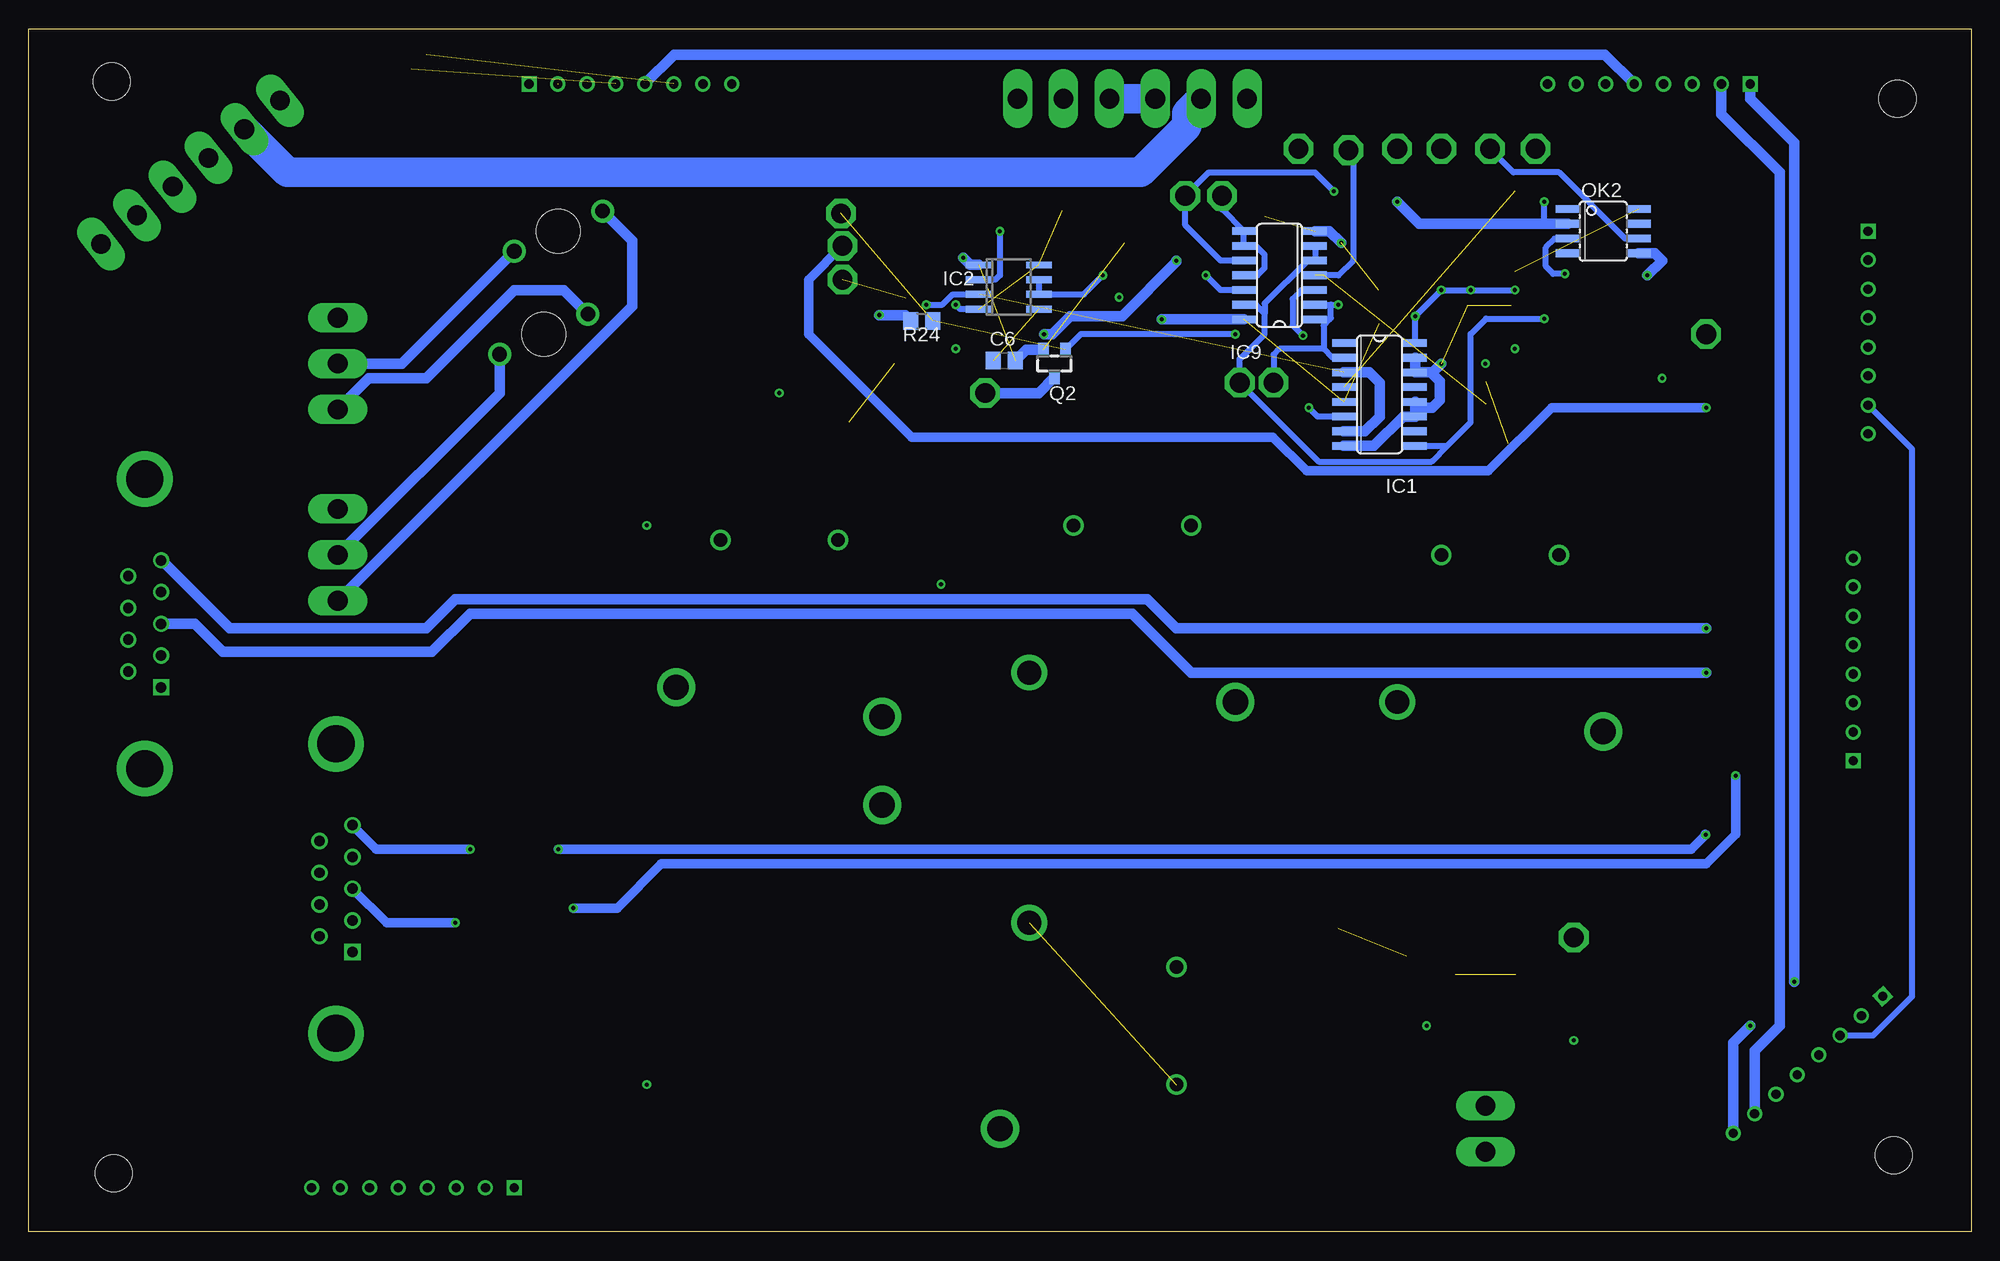
[diagram p6: board, bottom side, seen from below]

Size 167.62 x 103.81 mm. Coordinates in mm from the lower left corner, seen from the top.
Outline: 0,0 167.62,0 167.62,103.81 0,103.81 0,0
Copper layers ([2:[15:1+2*15+16]]): Top 0.035mm / dielectric 0.11mm / Route2 0.035mm / dielectric 1.2mm / Route15 0.035mm / dielectric 0.11mm / Bottom 0.035mm
Design rules "default *": minimum track width 6mil, minimum drill 0.35mm, track to track 6mil, track to pad 6mil, pad to pad 6mil, via to via 6mil, smd to smd 6mil, copper to edge 40mil, drill to drill 11mil, minimum pad ring 10mil, minimum via ring 8mil, stop-mask expansion 4mil, vias tented up to drill 0mil, thermal gap 10mil

### Footprints (pad centres in the part's own frame; a part is rotated, then mirrored left to right if it is on the bottom)
CON_22035085_MOL = drill 0.787 pad 1.143 square: 1 0,0 | drill 0.787 pad 1.143: 2 -2.489,0; 3 -5.004,0; 4 -7.493,0; 5 -10.008,0; 6 -12.497,0; 7 -15.011,0; 8 -17.501,0
KK-156-3 = drill 1.7 pad 2.184 long: 1 -3.96,0; 2 0,0; 3 3.96,0
C0805 = smd 1.3 x 1.5: 1 -0.95,0; 2 0.95,0
C1206 = smd 1.6 x 1.8: 1 -1.4,0; 2 1.4,0
C0805K = smd 1.3 x 1.6: 1 -1,0; 2 1,0
LD09P24A4GV00LF = drill 0.9 pad 1.4 square: 1 0,0 | drill 0.9 pad 1.4: 2 2.74,0; 3 5.48,0; 4 8.22,0; 5 10.96,0; 6 1.37,-2.84; 7 4.11,-2.84; 8 6.85,-2.84; 9 9.59,-2.84 | drill 3.2 pad 4.8: MH1 -7.015,-1.42; MH2 17.975,-1.42
SMB = smd 2.4 x 2.4: A 2.2,0; C -2.2,0
DIOM7959X262N = smd 2.2 x 3.15: 1 -3.5,0; 2 3.5,0
KK-156-6 = drill 1.7 pad 2.184 long: 1 -9.9,0; 2 -5.94,0; 3 -1.98,0; 4 1.98,0; 5 5.94,0; 6 9.9,0
01530008 = drill 1.27 pad 2: 1 1.727,3.81; 2 -1.727,-3.81 | hole 3.785: 0,0
KK-156-2 = drill 1.7 pad 2.184 long: 1 -1.98,0; 2 1.98,0
3,2 = hole 3.2: 0,0
SO16 = smd 0.66 x 2.032: 1 -4.445,-3.073; 2 -3.175,-3.073; 3 -1.905,-3.073; 4 -0.635,-3.073; 5 0.635,-3.073; 6 1.905,-3.073; 7 3.175,-3.073; 8 4.445,-3.073; 9 4.445,3.073; 10 3.175,3.073; 11 1.905,3.073; 12 0.635,3.073; 13 -0.635,3.073; 14 -1.905,3.073; 15 -3.175,3.073; 16 -4.445,3.073
SO08 = smd 0.6 x 2.2: 1 -1.905,-2.6; 2 -0.635,-2.6; 3 0.635,-2.6; 4 1.905,-2.6; 5 1.905,2.6; 6 0.635,2.6; 7 -0.635,2.6; 8 -1.905,2.6
SOIC8 = smd 0.6 x 2.2: 1 -1.905,-2.6; 2 -0.635,-2.6; 3 0.635,-2.6; 4 1.905,-2.6; 5 1.905,2.6; 6 0.635,2.6; 7 -0.635,2.6; 8 -1.905,2.6
SO14 = smd 0.66 x 2.032: 1 -3.81,-3.073; 2 -2.54,-3.073; 3 -1.27,-3.073; 4 0,-3.073; 5 1.27,-3.073; 6 2.54,-3.073; 7 3.81,-3.073; 8 3.81,3.073; 9 2.54,3.073; 10 1.27,3.073; 11 0,3.073; 12 -1.27,3.073; 13 -2.54,3.073; 14 -3.81,3.073
T9AS1D12 = drill 2.19 pad 3.29: 1 -8.89,12.7; 2 8.89,15.24; 3 8.89,22.86 | drill 1.17 pad 1.77: 4 -5.08,0; 5 5.08,0
T9AS1D1248T9A = drill 1.17 pad 1.755: 1 0,0; 2 -10.16,0 | drill 2.06 pad 3.09: 3 -13.97,12.7 | drill 2.19 pad 3.3: 4 3.81,15.24
SML0805 = smd 1.2 x 1.2: A 1.05,0; C -1.05,0
SOIC08 = smd 0.66 x 2.032: 1 -1.905,-3.073; 2 -0.635,-3.073; 3 0.635,-3.073; 4 1.905,-3.073; 5 1.905,3.073; 6 0.635,3.073; 7 -0.635,3.073; 8 -1.905,3.073
SOT23 = smd 0.9 x 1.2: 1 -0.95,-1.2; 2 0.95,-1.2; 3 0,1.2
R1206 = smd 1.6 x 1.803: 1 -1.422,0; 2 1.422,0
R0805 = smd 1.3 x 1.5: 1 -0.95,0; 2 0.95,0
P1-17 = drill 1.702 pad 2.54 octagon: TP 0,0
TP11R = smd 1.1 x 1.1: TP 0,0

### Placement (x,y rotation side)
BMS_I/O  8.89,86.36 90 top
BMS_POWER/GND  140.97,58.42 90 top
C1  52.07,78.36 0 top
C2  121.92,13.97 0 top
C3  89.92,82.8 90 top
C4  48.77,22.86 90 top
C5  34.29,20.32 90 top
C6  83.44,75.18 0 bottom
C7  73.03,83.95 90 top
C8  86.49,86.87 270 top
C9  59.94,87.63 0 top
CAN1  156.21,46.99 90 top
CAN2  139.7,24.13 90 top
D1  99.06,69.85 180 top
D2  118.11,67.31 90 top
D3  57.15,13.97 90 top
D5  125.73,67.31 90 top
D7  31.75,71.12 0 top
D8  73.91,73.41 270 top
EMSDC  72.39,97.79 180 top
EMSDC1  69.85,-11.43 0 top  (outside the outline)
F1  123.19,77.47 270 top
F2  121.92,86.36 90 top
FAN  41.91,8.89 90 top
H1  6.35,97.79 90 top
H2  6.68,6.6 0 top
H3  160.48,99.28 0 top
H4  160.3,5.04 90 top
IC1  51.05,72.26 270 bottom
IC2  83.06,81.53 270 bottom
IC4  41.91,21.59 90 top
IC9  59.69,82.55 90 bottom
ISOMETER_I/O  125.73,3.81 180 top
K2  102.87,59.69 180 top
K3  68.58,12.7 270 top
K6  35.56,58.42 180 top
K7  67.31,60.96 180 top
LED1  93.98,74.93 0 top
LED2  54.61,25.15 270 top
LED3  30.48,22.86 270 top
LED4  43.05,88.77 270 top
LED5  46.99,88.77 270 top
LED6  39.37,88.77 270 top
LED7  34.29,74.93 180 top
LED8  67.82,71.37 180 top
MISC_I/O  10.16,40.64 270 top
OK2  31.75,86.36 270 bottom
POWER/GND  140.97,74.93 90 top
PRECHARGE  7.62,20.32 137.5 top
PRECHARGE/AIRS  153.67,91.44 141.3 top
Q1  40.64,78.74 180 top
Q2  79.12,74.93 180 bottom
Q3  44.45,78.74 180 top
Q4  40.64,72.39 90 top
R1  123.19,27.94 90 top
R2  55.88,87.63 0 top
R3  31.75,82.3 180 top
R4  128.27,27.94 90 top
R5  67.94,77.34 0 top
R6  46.99,83.82 90 top
R7  43.18,83.82 90 top
R8  39.37,83.82 90 top
R9  91.95,81.53 270 top
R10  79.38,88.14 180 top
R11  89.28,86.87 90 top
R12  31.75,80.01 0 top
R14  29.21,74.93 180 top
R15  67.82,74.8 0 top
R19  40.89,68.07 0 top
R20  98.81,73.91 90 top
R21  52.07,22.86 90 top
R22  30.48,17.78 90 top
R24  90.55,78.61 0 bottom
R25  52.07,81.28 0 top
THERMAL_EX_I/0  124.46,99.06 0 top
TP1  41.53,93.47 0 top
TP2  53.72,93.34 0 top
TP3  49.53,93.47 0 top
TP4  97.41,82.17 0 top
TP5  60.2,73.28 0 top
TP6  63.12,73.28 0 top
TP7  45.72,93.47 0 top
TP8  133.35,101.6 0 top
TP9  134.62,100.33 0 top
TP10  37.59,93.47 0 top
TP11  64.64,89.41 0 top
TP12  58.04,93.47 0 top
TP14  85.09,72.39 0 top
TP16  67.82,89.41 0 top
TP17  97.54,87.88 0 top
TP21  22.86,77.47 0 top
TP23  97.41,85.09 0 top
TP24  34.29,25.4 0 top
WIFI_MODULE  19.05,99.06 180 top

### Tracks (layer width: path | path; a pad name or v marks a point on that pad's centre or on a via)
+3V3  (via drill 0.35)  (5 unrouted)
  Top 0.508: IC4.1 46.54,19.68 | C4.1 46.54,19.68 | 46.54,19.68 46.54,18.23 v46.99,17.78 47.94,17.78 R21.1 | R7.1 v43.18,81.28 | v39.37,81.28 R8.1 | R6.1 45.72,81.6 v45.72,81.28 | v87.63,80.01 89.47,81.85 C3.1 | C1.1 48.64,78.36 v47.98,79.02
  Top 0.889: IC4.2 IC4.1 | R5.2 68.89,77.78 v69.85,78.74 | C2.1 119.7,12.7 v114.3,12.7
  Route15 0.508: v46.99,17.78 43.18,13.97 18.93,13.97 PRECHARGE.6 | 52.07,85.09 48.26,81.28 v45.72,81.28
  Route15 0.889: v69.85,78.74 69.85,83.82
  Bottom 0.508: v39.37,81.28 v43.18,81.28 v45.72,81.28 v47.98,79.02 IC1.16 | IC2.4 87.25,79.63 v87.63,80.01
  Bottom 0.889: v69.85,78.74 IC9.14
  pour Route15 (rank 2): 0,104.14 165.1,104.14 167.64,101.6 167.64,0 1.27,0 0,-1.27
+12V  (via drill 0.35)  (1 unrouted)
  Top 0.889: C5.1 34.29,17.78 | 34.29,17.78 33.02,16.51 | 33.02,16.51 30.8,16.51 R22.1 | 33.02,16.51 v34.29,16.51 | IC4.8 38.04,19.68 36.13,17.78 34.29,17.78 | D7.C 28.26,72.41 28.26,73.66 | 28.26,73.66 R14.2 | 28.26,73.66 v26.67,73.66 | R15.2 69.57,75.61 D8.C 73.91,80.26 v73.53,80.64 | D5.1 D2.1 115.26,60.96 v114.3,60.96 | D1.C 101.26,70.51 R20.1 102.3,72.96 v102.87,72.39
  Top 1.27: D3.C 67.65,11.77 K3.1
  Route15 0.889: ISOMETER_I/O.2 110.44,21.59 109.22,21.59
  Route15 1.27: PRECHARGE.5 17.95,16.51 26.67,16.51
  pour Route15: 59.69,5.08 38.1,5.08 2.54,40.64 2.54,54.61 15.24,67.31 15.24,77.47 27.94,90.17 45.72,90.17 58.42,77.47 59.69,77.47 64.77,82.55 81.28,82.55 86.36,77.47 101.6,77.47 104.14,80.01 111.76,80.01 119.38,72.39 127,72.39 135.89,63.5 144.78,63.5 144.78,33.02 148.59,29.21 148.59,6.35 146.05,3.81 125.73,3.81 121.92,7.62 121.92,21.59 80.01,21.59 78.74,20.32 74.93,20.32
AMS_LED-  (via drill 0.35)
  Top 0.889: Q1.3 40.64,77.47 v39.37,76.2
  Route2 0.889: v39.37,76.2 25.4,62.23 25.4,52.07 23.98,50.65 MISC_I/O.5
CAN1_H  (via drill 0.35)
  Route2 0.813: MISC_I/O.4 3.81,54.48 3.81,81.28 BMS_I/O.1
  Route2 0.889: MISC_I/O.4 22.73,48.13 v22.86,48.26
  Bottom 0.889: v22.86,48.26 67.31,48.26 72.39,53.34 129.54,53.34 132.84,50.04 150.88,50.04 153.31,52.47 CAN1.3
CAN1_L  (via drill 0.35)
  Route2 0.813: MISC_I/O.6 5.08,58.22 5.08,77.55 BMS_I/O.3
  Route2 0.889: MISC_I/O.6 21.79,53.14 v22.86,52.07
  Bottom 0.889: v22.86,52.07 68.58,52.07 71.12,54.61 130.81,54.61 133.35,52.07 150.29,52.07 156.17,57.95 CAN1.5
CAN2_H  (via drill 0.35)
  Top 0.813: v130.81,26.67 130.66,26.52 R4.1 R1.1 122.07,26.52 v120.65,27.94 | v20.32,39.37 20.32,50.8 15.47,55.65 MISC_I/O.7
  Route2 0.813: MISC_I/O.7 10.16,55.88 6.35,59.69 6.35,71.32 BMS_I/O.6 12.7,77.67 12.7,86.36 24.05,97.71 WIFI_MODULE.3
  Route15 0.889: WIFI_MODULE.3 24.13,99.06 26.67,101.6 116.92,101.6 THERMAL_EX_I/0.3
  Bottom 0.813: CAN2.3 136.76,26.67 v130.81,26.67 | v120.65,27.94 116.84,27.94 113.03,31.75 22.86,31.75 20.32,34.29 v20.32,39.37
CAN2_L  (via drill 0.35)
  Top 0.813: v129.54,33.02 128.27,31.75 | 128.27,31.75 R4.2 | 128.27,31.75 123.19,31.75 | 123.19,31.75 R1.2 | 123.19,31.75 v121.92,33.02
  Route2 0.813: MISC_I/O.8 10.16,67.59 BMS_I/O.8 13.97,73.94 13.97,85.09 24.13,95.25 26.67,95.25 29.06,97.64 WIFI_MODULE.5
  Route15 0.813: v22.9,34.25 16.51,40.64 16.51,55.88 14.25,58.14 MISC_I/O.8
  Bottom 0.813: 22.95,34.29 v22.9,34.25 24.13,33.02 v121.92,33.02 | CAN2.5 137.63,33.02 v129.54,33.02
  Bottom 0.889: WIFI_MODULE.5 31.6,101.6 111.91,101.6 THERMAL_EX_I/0.5
CHARGE_POWER  (1 unrouted)
  Top 0.889: D5.2 125.73,74.47 F1.1 129.54,78.28 129.54,91.44 121.92,99.06
  Route2 0.889: WIFI_MODULE.2 24.08,101.6 119.43,101.6 THERMAL_EX_I/0.2
  Bottom 0.889: PRECHARGE.7 18.69,15.6 16.51,17.78 16.51,91.44 21.54,96.47 WIFI_MODULE.2 | BMS_POWER/GND.2 127,72.39 F1.1
CHARGE_SAFE  (via drill 0.35)
  Top 0.508: BMS_I/O.2 20.37,83.87 31.75,95.25 47.75,95.25 TP3.TP 46.99,90.93 LED5.C
  Route15 0.508: v66.04,82.55 60.45,82.55 TP3.TP
  Bottom 0.508: IC9.12 64.77,81.28 v66.04,82.55
CHASSIS_GND
  Route15 1.27: MISC_I/O.1 20.32,30.48 104.06,30.48 ISOMETER_I/O.3
DISCHARGE_ENABLE  (via drill 0.35)
  Top 0.508: 32.7,78.8 v36.83,78.8 40.45,78.8 Q1.1 41.59,88.36 LED4.C 45.72,92.49 TP7.TP
  Top 0.813: BMS_I/O.4 19.18,78.87 20.32,80.01 25.4,80.01 27.43,77.98 31.88,77.98 32.7,78.8 R12.2
  Bottom 0.508: IC1.9 45.21,67.82 | v36.83,78.8 41.85,78.8 43.18,77.47 43.18,69.85 45.21,67.82 | 60.96,79.25 60.96,77.47 63.12,75.31 TP6.TP 56.31,66.47 46.56,66.47 45.21,67.82 | IC9.13 61.72,80.01 60.96,79.25 | 60.96,79.25 60.96,80.13 57.27,83.82 IC9.5 IC9.6
FAN+
  Top 2.54: FAN.1 81.84,6.91 K3.4
FAN_ENABLE
  Top 0.813: BMS_I/O.5 57.15,28.09 D3.A
  Top 1.27: D3.A 61.89,16.17 K3.2
GND  (via drill 0.35)  (9 unrouted)
  Top 0.889: 36.83,20.95 IC4.7 IC4.6 | 36.83,20.95 34.6,20.95 C5.2 | 36.83,20.95 36.83,22.86 35.56,24.13 | 35.56,24.13 TP24.TP | LED3.C 30.7,24.13 35.56,24.13 | IC4.3 46.35,22.23 47.94,23.81 C4.2 | R12.1 30.8,81.28 | 30.8,81.28 R3.2 | C1.2 53.02,79.06 52.15,79.93 52.12,79.93 51.12,80.94 R25.1 | 30.8,81.28 29.21,81.28 v27.94,82.55 | v45.72,74.93 44.13,73.34 Q4.2 | 89.28,85.09 R11.1 C8.2 | 89.28,85.09 89.28,84.39 C3.2 | 89.28,85.09 88.27,84.07 v87,84.07 | v94.23,79.12 94.23,81.03 92.78,82.48 R9.1 | C2.2 125.73,11.11 ISOMETER_I/O.1
  Bottom 0.889: OK2.5 27.3,84.45 26.67,83.82 v27.94,82.55 | 47.98,71.12 IC1.11 49.02,70.36 51.56,67.82 IC1.8 | 47.98,71.12 IC1.12 | 47.98,71.12 46.48,71.12 45.85,71.75 45.85,73.41 46.55,74.11 | 46.55,74.11 46.61,74.17 IC1.14 IC1.15 | 46.55,74.11 v45.72,74.93 | IC9.7 55.37,86.36 v54.36,85.34 | Q2.2 81.54,76.13 C6.2 | v87,84.07 86.36,83.44 IC2.1 | R24.1 92.01,79.12 v94.23,79.12
  pour Route2: 0,104.14 167.64,104.14 167.64,-1.27 0,-1.27
HIGHEST_TEMP  (1 unrouted)
IMD_COIL_OUT
  Top 0.889: TP14.TP 83.91,71.21 D8.A 73.75,71.37 LED8.C
  Top 1.27: K7.2 73.91,64.52 D8.A
  Bottom 0.889: Q2.3 80.46,72.39 TP14.TP
IMD_LED-  (via drill 0.35)
  Top 0.889: v41.91,74.93 44.45,77.47 Q3.3
  Route2 0.889: MISC_I/O.3 10.24,45.72 22.86,45.72 27.94,50.8 27.94,60.96 v41.91,74.93
LOWEST_TEMP  (1 unrouted)
N$1  (via drill 0.35)
  Top 0.508: v54.99,89.79 54.99,87.69 R2.1
  Bottom 0.508: IC9.10 64.77,83.82 67.82,86.87 TP16.TP 65.79,91.44 56.64,91.44 v54.99,89.79
N$2
  Bottom 0.889: POWER/GND.2 135.43,74.93 F2.2
N$3
  Route2 2.54: PRECHARGE/AIRS.1 159.79,85.25 159.47,84.92 135.72,84.92 133.35,82.55 133.35,67.31 118.11,52.07 101.6,52.07 K2.2
N$4
  Bottom 0.889: POWER/GND.1 138.28,73.66 133.35,73.66 125.73,81.28 121.46,81.28 F1.2
N$5  (1 unrouted)
  Top 0.508: TP1.TP 39.37,91.31 LED6.C
  Bottom 0.508: OK2.6 29.84,85.72 35.56,91.44 39.5,91.44 TP1.TP
N$6
  Bottom 0.508: TP11.TP 64.64,88.24 IC9.8 IC9.9 61.72,85.09 60.96,84.33 60.96,83.19 61.59,82.55 IC9.11
N$7  (via drill 0.35)
  Top 0.508: R3.1 33.08,82.68 v35.05,82.68
  Bottom 0.508: v35.05,82.68 36.07,82.68 36.7,83.31 36.7,84.96 35.94,85.72 OK2.3
N$8  (via drill 0.35)  (2 unrouted)
  Route2 0.508: v57.66,77.34 57.78,77.47 v63.5,77.47
  Bottom 0.508: IC9.3 57.78,81.28 58.55,80.52 58.55,78.23 v57.66,77.34 | v63.5,77.47 76.83,77.47 Q2.1
N$9  (via drill 0.35)
  Top 0.508: Q3.1 45.47,80.01 46.99,80.01 50.16,83.19 51.44,83.19 53.02,81.6 R25.2 53.34,81.28 v54.61,80.01
  Bottom 0.508: IC9.2 55.24,80.01 | 55.24,80.01 v54.61,80.01 | IC9.1 55.37,78.74 | 55.37,78.74 55.24,78.87 55.24,80.01 | IC1.2 55.12,75.44 55.88,76.2 | 55.88,76.2 55.88,78.23 55.37,78.74 | 55.88,76.2 59.69,76.2 60.2,75.69 TP5.TP
N$10  (via drill 0.35)
  Top 0.508: v57.15,71.12 57.15,74.93 59.69,77.47 59.69,86.88 C9.1 | R2.2 C9.1 | TP12.TP 58.94,92.57 C9.1
  Bottom 0.508: IC1.6 56.39,70.36 v57.15,71.12
N$11
  Route15 2.54: K2.1 132.08,67.31 132.08,85.09 138.43,91.44 145.32,91.44 PRECHARGE/AIRS.5
  Bottom 2.54: EMSDC.5 67.71,96.53 67.71,95.4 71.67,91.44 145.32,91.44 PRECHARGE/AIRS.5
N$12
  Route15 2.54: K2.3 100.33,43.18 114.3,43.18 135.89,64.77 135.89,83.82 137.16,85.09 155.67,85.09 PRECHARGE/AIRS.2
N$14
  Route15 1.27: K7.4 63.5,64.9 78.36,79.76 78.36,97.76 EMSDC.2
N$15
  Top 0.889: D7.A 35.22,72.39 36.83,72.39 | 36.83,72.39 Q4.3 | 36.83,72.39 36.83,73.44 LED7.C 33.68,76.59 23.59,76.59 22.86,77.32 TP21.TP
  Top 1.27: K6.2 43.18,60.96 38.1,60.96 33.95,65.11 D7.A
N$16  (2 unrouted)
  Top 0.889: Q4.1 R19.2
  Bottom 0.508: TP2.TP 53.34,92.96 53.34,83.82 54.61,82.55 55.88,82.55
N$17  (via drill 0.35)
  Top 0.508: v74.93,82.55 C7.1
  Top 0.889: R5.1 67,79.69 69.85,82.55 C7.1
  Bottom 0.508: IC2.7 IC2.6 76.58,80.9 v74.93,82.55
N$18
  Top 0.889: LED7.A R14.1
N$19
  Bottom 2.54: EMSDC.3 EMSDC.4
N$20
  Top 0.889: R15.1 66.87,71.47 LED8.A
N$21
  Route15 1.27: K6.4 33.02,41.91 74.93,41.91 K7.3
N$22
  Top 0.813: LED1.A 98.74,74.93 R20.2
N$23
  Top 0.889: R21.2 52.36,24.1 LED2.A
N$24
  Top 0.889: R22.2 LED3.A
N$25
  Top 0.508: LED4.A 43.18,87.6 R7.2
N$26
  Top 0.508: R6.2 LED5.A
N$27
  Top 0.508: R8.2 LED6.A
N$28  (via drill 0.35)
  Top 0.508: R10.1 85.09,88.14 | 85.09,88.14 86.17,88.14 C8.1 R11.2 | 85.09,88.14 83.82,86.87 v83.82,86.36
  Bottom 0.508: v83.82,86.36 83.82,82.55 84.2,82.17 IC2.2
N$32  (1 unrouted)
OK_HS  (via drill 0.35, 0.35 layers 1-15)
  Top 0.508: v36.83,88.9 36.83,92.71 TP10.TP
  Route2 0.889: v124.46,36.83 100.33,36.83 96.52,33.02 90.17,33.02 87.63,35.56 87.63,54.61 v88.9,55.88 | v87.63,76.2 86.36,77.47 v80.01,77.47
  Route15 0.889: ISOMETER_I/O.8 125.73,21.31 125.73,36.83 v124.46,36.83 | v88.9,55.88 88.9,74.93 v87.63,76.2 | v68.58,83.82 68.58,83.71 66.44,81.58 66.33,81.58 64.77,80.01 58.31,80.01 53.38,84.94 53.38,85.05 v49.53,88.9
  Bottom 0.508: 36.83,87 v36.83,88.9
  Bottom 0.889: v80.01,77.47 79.3,77.47 77.74,79.03 73.26,79.03 68.58,83.71 v68.58,83.82 | v49.53,88.9 47.62,87 36.83,87 OK2.2
PRECHARGE_EMSDC1
  Route2 1.27: PRECHARGE.1 24.13,36.83 40.64,36.83 K6.3
PRECHARGE_EMSDC2
  Route2 1.27: PRECHARGE.2 25.11,34.29 50.8,34.29 55.88,39.37 55.88,59.69 82.55,86.36 82.55,97.53 EMSDC.1
PRECHARGE_SELECT  (via drill 0.35)  (1 unrouted)
  Top 0.813: TP23.TP 100.33,82.17 100.33,80.01 97.79,77.47 93.98,77.47 92.93,76.42 LED1.C
  Top 1.27: D1.A 96.86,60.62 K2.5
  Route15 0.813: BMS_I/O.7 22.63,71.35 v22.86,71.12
  Bottom 0.508: PRECHARGE.3 8.46,16.94 5.08,20.32 5.08,67.54 BMS_I/O.7
  Bottom 0.813: v22.86,71.12 36.19,71.12 41.65,65.66 57.33,65.66 60.25,68.58 91.44,68.58 100.33,77.47 100.33,82.17 TP23.TP
READY_POWER  (via drill 0.35)
  Top 0.889: v19.05,17.78 v15.24,21.59 | D2.2 115.57,73.35 115.57,85.55 F2.1 | WIFI_MODULE.1 21.59,101.6 121.92,101.6 THERMAL_EX_I/0.1
  Route2 0.889: F2.1 124.46,94.44 THERMAL_EX_I/0.1
  Bottom 0.889: PRECHARGE.8 20.52,16.31 v19.05,17.78 | v15.24,21.59 15.24,93.98 19.05,97.79 WIFI_MODULE.1 | BMS_POWER/GND.1 115.57,79.86 115.57,85.55 F2.1
STARTUP_RESET  (via drill 0.35)  (2 unrouted)
  Top 0.508: R9.2 91.37,80.01 v90.17,80.01
  Bottom 0.508: v90.17,80.01 88.77,80.01 87.88,80.9 IC2.3
  Bottom 0.889: IC1.7 52.32,69.09 51.05,70.36 51.05,73.28 51.94,74.17 IC1.3